# Altium project INCUBATION_CONTROLLER.PrjPcb
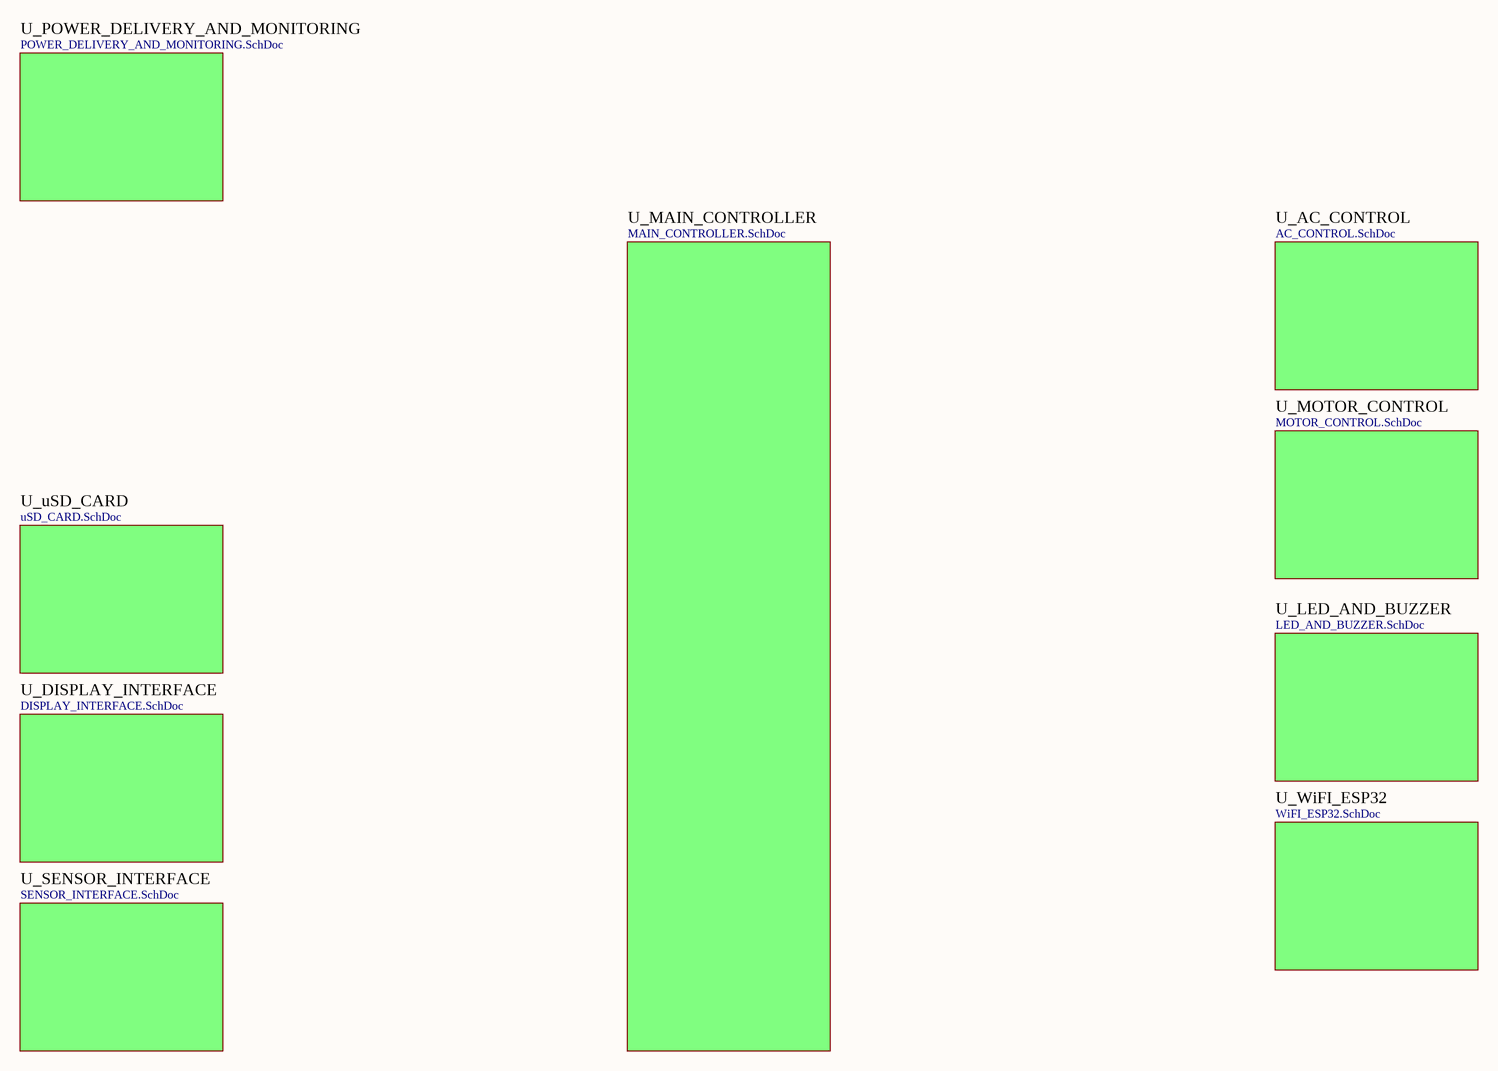
[diagram p0: MAIN.SchDoc]
13 sheets, 192 parts. Net scope: flat (ports and power ports of the same name join across sheets).
Board file: INCUBATION_CONTROLLER.PcbDoc
Sheets:
  MAIN.SchDoc
    U_POWER_DELIVERY_AND_MONITORING = POWER_DELIVERY_AND_MONITORING.SchDoc
      U_12V_SUPPLY = 12V_SUPPLY.SchDoc
      U_5V_SUPPLY = 5V_SUPPLY.SchDoc
      U_5V_ISOLATED_SUPPLY = 5V_ISOLATED_SUPPLY.SchDoc
      U_3V3_SUPPLY = 3V3_SUPPLY.SchDoc
      U_REVERSE_PROTECTION = REVERSE_PROTECTION.SchDoc
      U_3V3_MCU = 3V3_MCU.SchDoc
    U_AC_CONTROL = AC_CONTROL.SchDoc
    U_SENSOR_INTERFACE = SENSOR_INTERFACE.SchDoc
    U_LED_AND_BUZZER = LED_AND_BUZZER.SchDoc
    U_WiFI_ESP32 = WiFI_ESP32.SchDoc
    U_MAIN_CONTROLLER = MAIN_CONTROLLER.SchDoc

## Sheet MAIN.SchDoc
size A2; SheetNumber: 1; SheetTotal: 16

### Sub-sheets
U_AC_CONTROL = AC_CONTROL.SchDoc: no entries
U_DISPLAY_INTERFACE = DISPLAY_INTERFACE.SchDoc (file not in this document): no entries
U_LED_AND_BUZZER = LED_AND_BUZZER.SchDoc: no entries
U_MAIN_CONTROLLER = MAIN_CONTROLLER.SchDoc: no entries
U_MOTOR_CONTROL = MOTOR_CONTROL.SchDoc (file not in this document): no entries
U_POWER_DELIVERY_AND_MONITORING = POWER_DELIVERY_AND_MONITORING.SchDoc: no entries
U_SENSOR_INTERFACE = SENSOR_INTERFACE.SchDoc: no entries
U_uSD_CARD = uSD_CARD.SchDoc (file not in this document): no entries
U_WiFI_ESP32 = WiFI_ESP32.SchDoc: no entries

## Sheet POWER_DELIVERY_AND_MONITORING.SchDoc
size A4; SheetNumber: 2; SheetTotal: 16
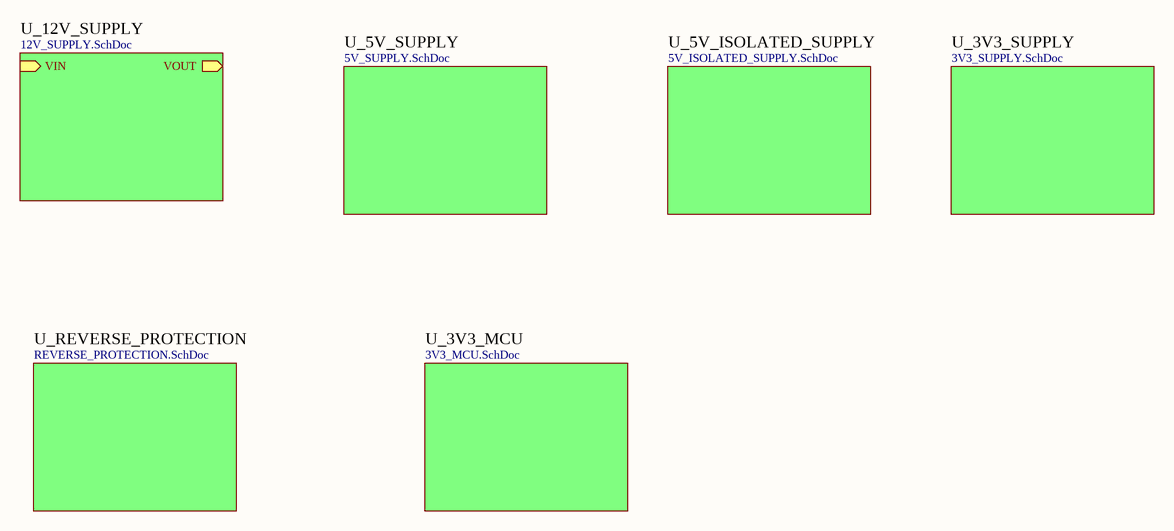
[diagram p1: POWER_DELIVERY_AND_MONITORING.SchDoc]

### Sub-sheets
U_3V3_MCU = 3V3_MCU.SchDoc: no entries
U_3V3_SUPPLY = 3V3_SUPPLY.SchDoc: no entries
U_5V_ISOLATED_SUPPLY = 5V_ISOLATED_SUPPLY.SchDoc: no entries
U_5V_SUPPLY = 5V_SUPPLY.SchDoc: no entries
U_12V_SUPPLY = 12V_SUPPLY.SchDoc: VIN (in), VOUT (out)
U_REVERSE_PROTECTION = REVERSE_PROTECTION.SchDoc: no entries

## Sheet 12V_SUPPLY.SchDoc
size A2; SheetNumber: 2; SheetTotal: 3
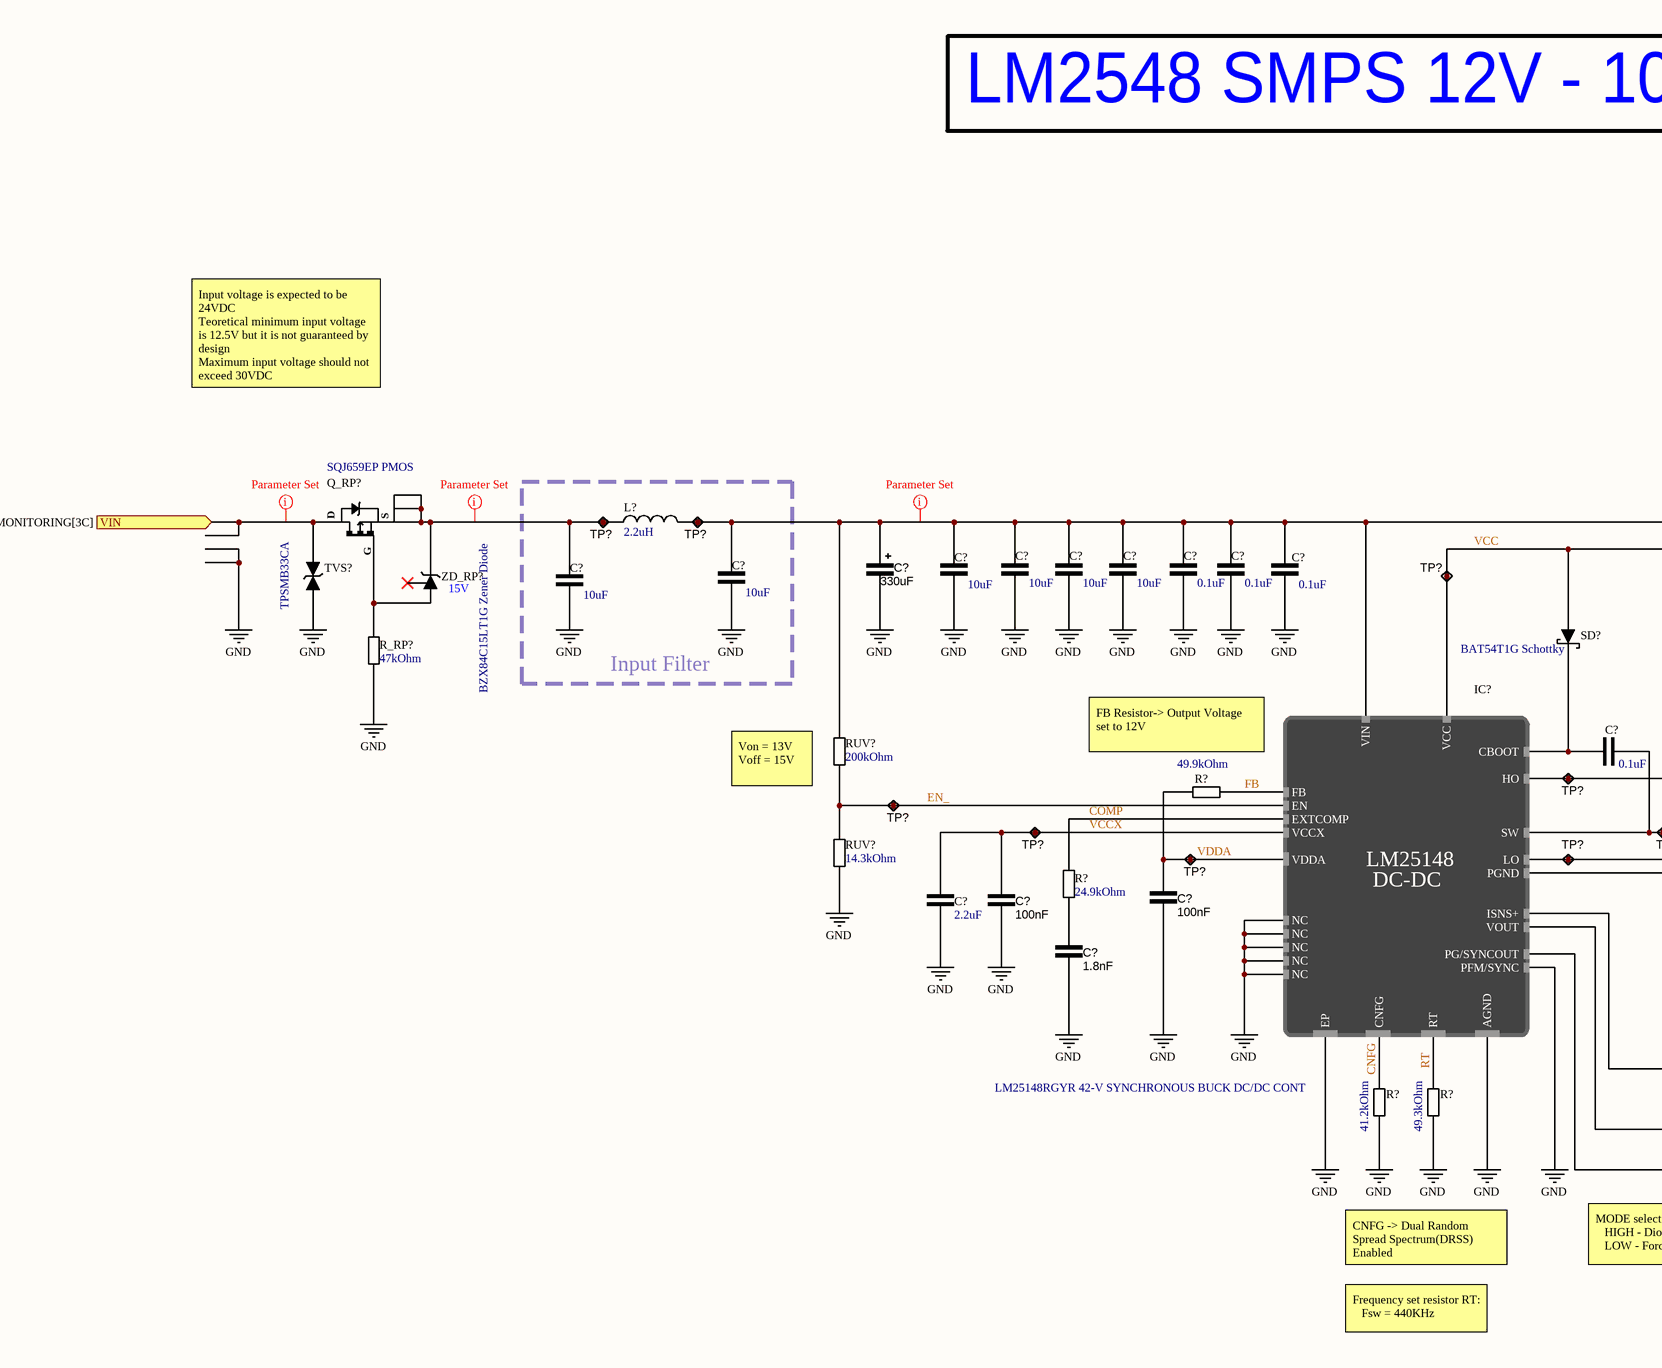
[diagram p2: 12V_SUPPLY.SchDoc, left]
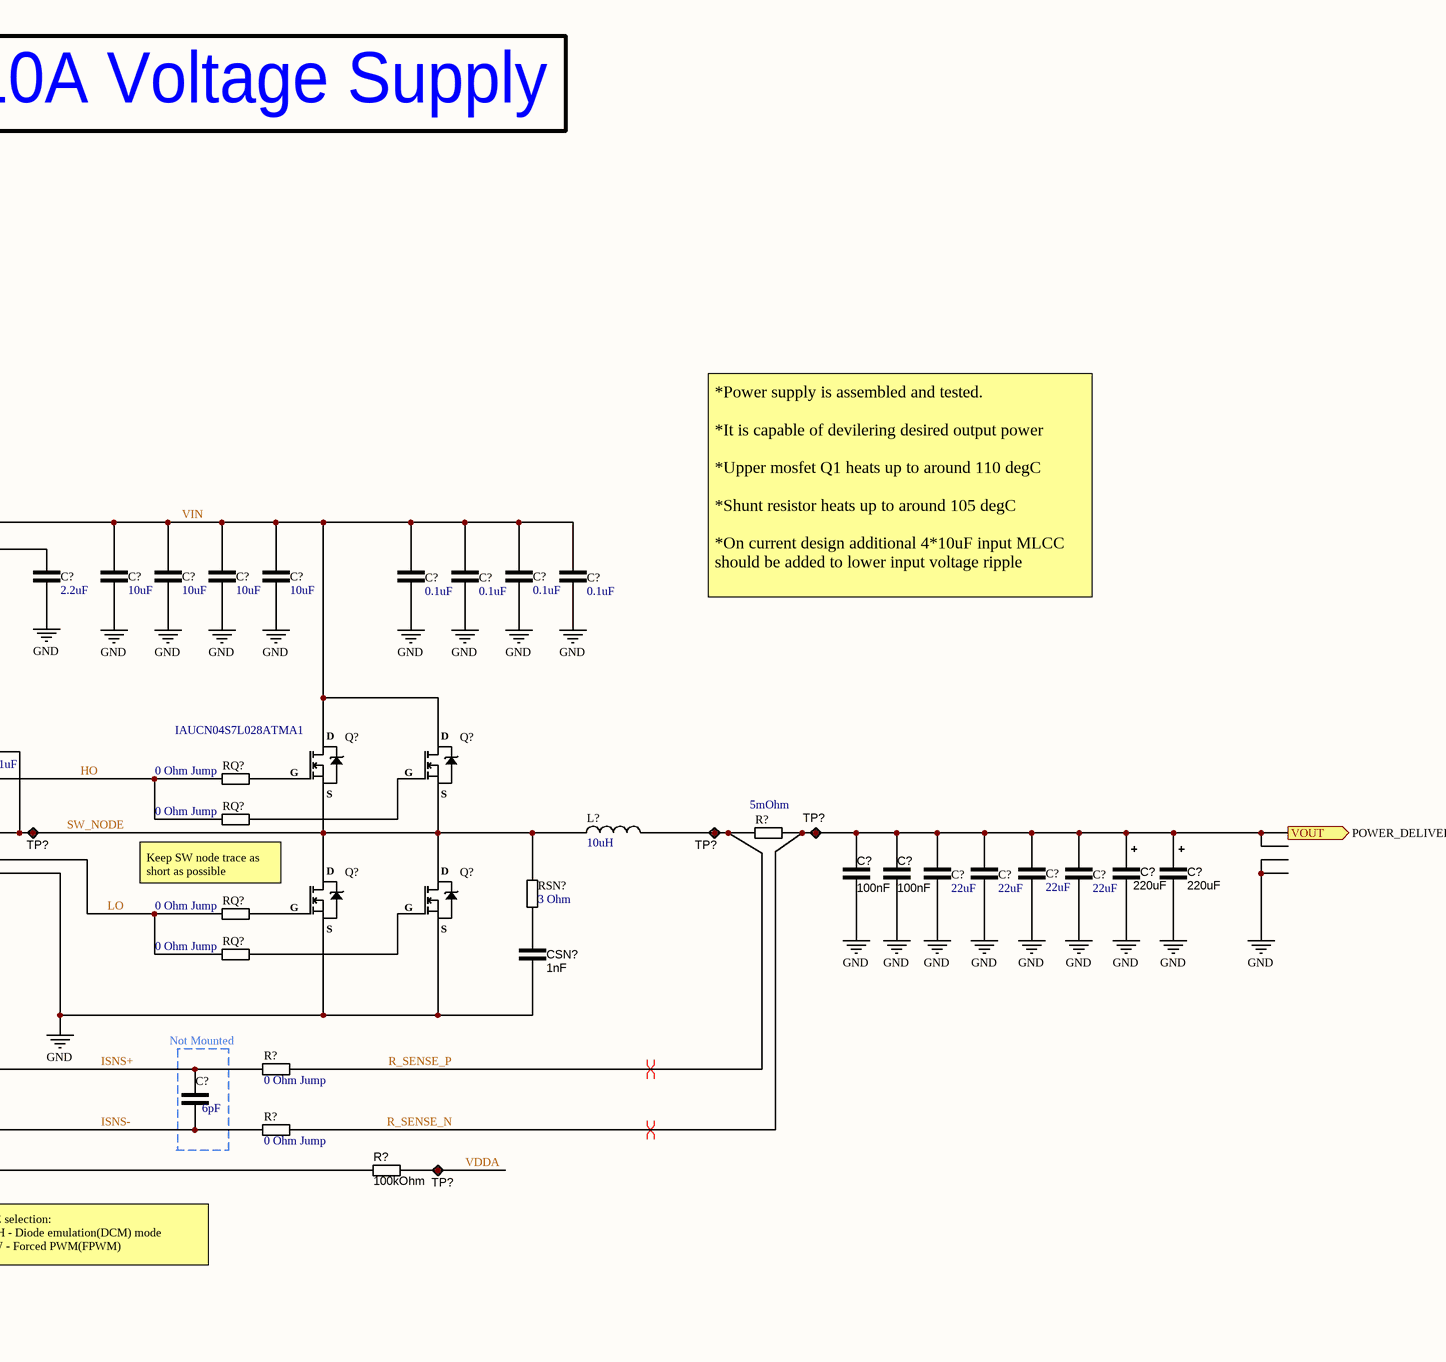
[diagram p3: 12V_SUPPLY.SchDoc, right]

### Parts
(Parts that share a designator on the sheet are numbered #1, #2 ... from top to bottom, then left to right.)
C?#1  330uF  [CAPAE109103X103M]
C?#2  10uF  [CAP_1206]
C?#3  10uF  [CAP_1206]
C?#4  10uF  [CAP_1206]
C?#5  10uF  [CAP_1206]
C?#6  0.1uF  [CAP_0603]
C?#7  0.1uF  [CAP_0603]
C?#8  0.1uF  [CAP_0603]
C?#9  10uF  [CAP_1206]
C?#10  2.2uF  [CAP_0603]
C?#11  10uF  [CAP_1206]
C?#12  10uF  [CAP_1206]
C?#13  10uF  [CAP_1206]
C?#14  10uF  [CAP_1206]
C?#15  0.1uF  [CAP_0603]
C?#16  0.1uF  [CAP_0603]
C?#17  0.1uF  [CAP_0603]
C?#18  0.1uF  [CAP_0603]
C?#19  10uF  [CAP_1206]
C?#20  0.1uF  [CAP_0603]
C?#21  100nF  [CAP_0603]
C?#22  100nF  [CAP_0603]
C?#23  22uF  [CAP_1210]
C?#24  22uF  [CAP_1210]
C?#25  22uF  [CAP_1210]
C?#26  22uF  [CAP_1210]
C?#27  220uF  [CAPAE109103X103M]
C?#28  220uF  [CAPAE109103X103M]
C?#29  2.2uF  [CAP_0603]
C?#30  100nF  [CAP_0603]
C?#31  100nF  [CAP_0603]
C?#32  1.8nF  [CAP_0603]
C?#33  6pF  [CAP_0402]
CSN?  1nF  [CAP_0805]
IC?#1  LM25148RGYR 42-V SYNCHRONOUS BUCK DC/DC CONT  [VQFN25_RGY_TEX]
L?#1  2.2uH  [IHLP-3232DZ-51]
L?#2  10uH  [INDP135126X65N]
Q?#1  IAUCN04S7L028ATMA1  [PG-TDSON-8-33]
Q?#2  IAUCN04S7L028ATMA1  [PG-TDSON-8-33]  (value not drawn)
Q?#3  IAUCN04S7L028ATMA1  [PG-TDSON-8-33]  (value not drawn)
Q?#4  IAUCN04S7L028ATMA1  [PG-TDSON-8-33]  (value not drawn)
Q_RP?  SQJ659EP PMOS  [PowerPAK SO-8L SINGLE]
R?#1  49.9kOhm  [RES_0603]
R?#2  5mOhm  [SENSE_RES_2512]
R?#3  24.9kOhm  [RES_0603]
R?#4  0 Ohm Jump  [RES_0402]
R?#5  41.2kOhm  [RES_0603]
R?#6  49.3kOhm  [RES_0603]
R?#7  0 Ohm Jump  [RES_0402]
R?#8  100kOhm  [RES_0603]
R_RP?  47kOhm  [RES_0603]
RQ?#1  0 Ohm Jump  [RES_0402]
RQ?#2  0 Ohm Jump  [RES_0402]
RQ?#3  0 Ohm Jump  [RES_0402]
RQ?#4  0 Ohm Jump  [RES_0402]
RSN?  3 Ohm  [RES_0805]
RUV?#1  200kOhm  [RES_0603]
RUV?#2  14.3kOhm  [RES_0603]
SD?  BAT54T1G Schottky  [SODFL371X135-2N]
TP?#1  Test point  [TestPoint]  (value not drawn)  (no BOM)
TP?#2  Test point  [TestPoint]  (value not drawn)  (no BOM)
TP?#3  Test point  [TestPoint]  (value not drawn)  (no BOM)
TP?#4  Test point  [TestPoint]  (value not drawn)  (no BOM)
TP?#5  Test point  [TestPoint]  (value not drawn)  (no BOM)
TP?#6  Test point  [TestPoint]  (value not drawn)  (no BOM)
TP?#7  Test point  [TestPoint]  (value not drawn)  (no BOM)
TP?#8  Test point  [TestPoint]  (value not drawn)  (no BOM)
TP?#9  Test point  [TestPoint]  (value not drawn)  (no BOM)
TP?#10  Test point  [TestPoint]  (value not drawn)  (no BOM)
TP?#11  Test point  [TestPoint]  (value not drawn)  (no BOM)
TP?#12  Test point  [TestPoint]  (value not drawn)  (no BOM)
TVS?  TPSMB33CA  [DO-214AA]
ZD_RP?  BZX84C15LT1G Zener Diode  [SOT95P245X96-3N]

### Blocks framed on the sheet
Input Filter: C?#9 C?#19 L?#1 TP?#1 TP?#2

### Ports
VIN (in, see POWER_DELIVERY_AND_MONITORING[3C]), VOUT (out, see POWER_DELIVERY_AND_MONITORING[4C])

### Nets
GND: C?#1.2 C?#2.1 C?#3.2 C?#4.2 C?#5.2 C?#6.2 C?#7.2 C?#8.1 C?#9.1 C?#10.1 C?#11.2 C?#12.2 C?#13.2 C?#14.2 C?#15.1 C?#16.1 C?#17.2 C?#18.1 C?#19.1 C?#21.1 C?#22.1 C?#23.2 C?#24.2 C?#25.1 C?#26.2 C?#27.2 C?#28.2 C?#29.2 C?#30.1 C?#31.1 C?#32.1 CSN?.1 IC?#1.1(NC) IC?#1.2(NC) IC?#1.7(AGND) IC?#1.10(PGND) IC?#1.18(PFM/SYNC) IC?#1.22(NC) IC?#1.23(NC) IC?#1.24(NC) IC?#1.25(EP) Q?#3.S(Source) Q?#4.S(Source) R?#5.1 R?#6.1 R_RP?.1 RUV?#2.1 TVS?.2(Anode)
CNFG: IC?#1.3(CNFG) R?#5.2
COMP: IC?#1.5(EXTCOMP) R?#3.2
EN_: IC?#1.19(EN) RUV?#1.1 RUV?#2.2 TP?#5.1
FB: IC?#1.6(FB) R?#1.2
HO: IC?#1.13(HO) RQ?#1.1 RQ?#2.1 TP?#4.1
ISNS+: C?#33.2 IC?#1.20(ISNS+) R?#4.1
ISNS-: C?#33.1 IC?#1.21(VOUT) R?#7.1
LO: IC?#1.11(LO) RQ?#3.1 RQ?#4.1 TP?#11.1
R_SENSE_N: C?#21.2 C?#22.2 C?#23.1 C?#24.1 C?#25.2 C?#26.1 C?#27.1 C?#28.1 R?#2.2 R?#7.2 TP?#9.1 ; port VOUT
R_SENSE_P: L?#2.2 R?#2.1 R?#4.2 TP?#8.1
RT: IC?#1.4(RT) R?#6.2
SW_NODE: C?#20.1 IC?#1.14(SW) L?#2.1 Q?#1.S(Source) Q?#2.S(Source) Q?#3.D(Drain) Q?#4.D(Drain) RSN?.2 TP?#7.1
VCC: C?#10.2 IC?#1.9(VCC) SD?.1(Anode) TP?#3.1
VCCX: C?#29.1 C?#30.2 IC?#1.16(VCCX) TP?#6.1
VDDA: C?#31.2 IC?#1.8(VDDA) R?#1.1 R?#8.2 TP?#10.1 TP?#12.1
VIN: C?#1.1 C?#2.2 C?#3.1 C?#4.1 C?#5.1 C?#6.1 C?#7.1 C?#8.2 C?#9.2 C?#11.1 C?#12.1 C?#13.1 C?#14.1 C?#15.2 C?#16.2 C?#17.1 C?#18.2 IC?#1.12(VIN) L?#1.2 Q?#1.D(Drain) Q?#2.D(Drain) RUV?#1.2 TP?#2.1
NetC?#19_2: C?#19.2 L?#1.1 Q_RP?.S(S1) TP?#1.1 ZD_RP?.3(Cathode)
NetC?#20_2: C?#20.2 IC?#1.15(CBOOT) SD?.2(Cathode)
NetC?#32_2: C?#32.2 R?#3.1
NetC?#61_2: Q_RP?.D TVS?.1(Cathode) ; port VIN
NetCSN?_2: CSN?.2 RSN?.1
NetIC?#1_17: IC?#1.17(PG/SYNCOUT) R?#8.1
NetQ?#1_G: Q?#1.G(Gate) RQ?#1.2
NetQ?#2_G: Q?#2.G(Gate) RQ?#2.2
NetQ?#3_G: Q?#3.G(Gate) RQ?#3.2
NetQ?#4_G: Q?#4.G(Gate) RQ?#4.2
NetQ_RP?_G: Q_RP?.G R_RP?.2 ZD_RP?.1(Anode)

Not connected (* = marked no-connect by the designer): ZD_RP? 2(Anode)*

### Layout directives
differential pair: R_SENSE_N, R_SENSE_P
rule Clearance Constraint [Clearance = 20mil]: NetC?#19_2, NetC?#61_2
rule Clearance Constraint [Generic clearance = 20mil, and 1 value(s) for objects]: VIN

### Notes on the sheet
- LM2548 SMPS 12V - 10A Voltage Supply
- Input voltage is expected to be 24VDC
  Teoretical minimum input voltage is 12.5V but it is not guaranteed by design
  Maximum input voltage should not exceed 30VDC
- (near ZD_RP?) 15V
- *Power supply is assembled and tested.
  *It is capable of devilering desired output power
  *Upper mosfet Q1 heats up to around 110 degC
  *Shunt resistor heats up to around 105 degC
  *On current design additional 4*10uF input MLCC should be added to lower input voltage ripple
- (near RUV?#1) Von = 13V
  Voff = 15V
- (near IC?#1) FB Resistor-> Output Voltage set to 12V
- Keep SW node trace as short as possible
- Not Mounted
- CNFG -> Dual Random Spread Spectrum(DRSS) Enabled
- MODE selection:
  HIGH - Diode emulation(DCM) mode
  LOW - Forced PWM(FPWM)
- Frequency set resistor RT:
  Fsw = 440KHz
- (in symbol LM25148RGYR) LM25148; DC-DC

### Library data of the parts
C?#1 = C000026: 330 µF 50 V Aluminum Electrolytic Capacitors Radial, Can - SMD 120mOhm @ 100kHz 2000 Hrs @ 105°C; Manufacturer Product Number: EMZR500ARA331MJA0G; capacitance: 330uF; ComponentLink1Description: DigiKey; ComponentLink1URL: https://www.digikey.com/en/products/detail/chemi-con/EMZR500ARA331MJA0G/5824768; DigiKey Part Number: 565-EMZR500ARA331MJA0GCT-ND
C?#2-C?#5 C?#9 C?#11-C?#14 C?#19 = C000017: 10 µF ±10% 50V Ceramic Capacitor X7R 1206 (3216 Metric); Manufacturer Product Number: CL31B106KBHNNNE; capacitance: 10uF; ComponentLink1Description: DigiKey; ComponentLink1URL: https://www.digikey.com/en/products/detail/samsung-electro-mechanics/CL31B106KBHNNNE/5961251; DigiKey Part Number: 1276-6767-1-ND
C?#6-C?#8 C?#15-C?#18 C?#20 = C000018: 0.1 µF ±10% 50V Ceramic Capacitor X7R 0603 (1608 Metric); Manufacturer Product Number: CL10B104KB8NNNC; capacitance: 0.1uF; ComponentLink1Description: DigiKey; ComponentLink1URL: https://www.digikey.com/en/products/detail/samsung-electro-mechanics/CL10B104KB8NNNC/3886658; DigiKey Part Number: 1276-1000-1-ND
C?#10 C?#29 = C000014: 8 pF ±0.05pF 25V Ceramic Capacitor C0G, NP0 01005 (0402 Metric); Manufacturer Product Number: GRM188C71C225KE11D; ComponentLink1Description: DigiKey; ComponentLink1URL: https://www.digikey.com/en/products/detail/murata-electronics/GRM188C71C225KE11D/4905311; DigiKey Part Number: 490-12731-1-ND; capacitance: 2.2uF
C?#21 C?#22 C?#30 C?#31 = C000007: 0.1 µF ±10% 25V Ceramic Capacitor X7R 0603 (1608 Metric); Manufacturer Product Number: KAM15AR71E104KT; ComponentLink1Description: DigiKey; ComponentLink1URL: https://www.digikey.com/en/products/detail/kyocera-avx/06033C104K4T2A/8019250; capacitance: 100nF; DigiKey Part Number: 478-KAM15AR71E104KTCT-ND
C?#23-C?#26 = C000032: 22 µF ±10% 25V Ceramic Capacitor X7R 1210 (3225 Metric); Manufacturer Product Number: CL32B226KAJNNNE; DigiKey Part Number: 1276-3392-1-ND; ComponentLink1Description: DigiKey; ComponentLink1URL: https://www.digikey.com/en/products/detail/samsung-electro-mechanics/CL32B226KAJNNNE/3889050; capacitance: 22uF
C?#27 C?#28 = C000033: 220 µF 35 V Aluminum - Polymer Capacitors Radial, Can - SMD 23mOhm 1000 Hrs @ 150°C; Manufacturer Product Number: A785MN227M1VLAS023; capacitance: 220uF; ComponentLink1Description: DigiKey; ComponentLink1URL: https://www.digikey.com/en/products/detail/kemet/A785MN227M1VLAS023/22003773?s=N4IgTCBcDaIIIHYAcBWAsgOTGBaCMAagDJwDKADGAMwgC6AvkA; DigiKey Part Number: 399-A785MN227M1VLAS023CT-ND
C?#32 = C000027: 1800 pF ±10% 25V Ceramic Capacitor X7R 0603 (1608 Metric); Manufacturer Product Number: C0603C182K3RACTU; ComponentLink1Description: DigiKey; ComponentLink1URL: https://www.digikey.com/en/products/detail/kemet/C0603C182K3RAC7867/2200107; DigiKey Part Number: 399-15370-1-ND; capacitance: 1.8nF
C?#33 = C000016: 6 pF ±0.5pF 25V Ceramic Capacitor C0G, NP0 0402 (1005 Metric); Manufacturer Product Number: CBR04C609D3GAC; DigiKey Part Number: 399-CBR04C609D3GACCT-ND; ComponentLink1Description: DigiKey; ComponentLink1URL: https://www.digikey.com/en/products/detail/kemet/CBR04C609D3GAC/18137865?s=N4IgjCBcpgLFoDGUBmBDANgZwKYBoQB7KAbXAFYBOAJlgHYQBdAgBwBcoQBlNgJwEsAdgHMQAXwJgAbAhDJI6bPiKkQAZkphyADiasOkbnyGiJIagAZYlWfMW4CxSGSkACFgDE9IdpwCqgvxsAPIoALI4aFgArrw44gQAtNS2UHzRyk5k5ExieUA; capacitance: 6pF
CSN? = C000035: 1000 pF ±10% 100V Ceramic Capacitor X7R 0805 (2012 Metric); Manufacturer Product Number: CC0805KRX7R0BB102; capacitance: 1nF; ComponentLink1Description: DigiKey; ComponentLink1URL: https://www.digikey.com/en/products/detail/yageo/CC0805KRX7R0BB102/2833637; DigiKey Part Number: 311-1472-1-ND
IC?#1 = LM25148RGYR: Buck Regulator Positive Output Step-Down DC-DC Controller IC 24-VQFN (5.5x3.5); DigiKey Part Number: 296-LM25148RGYRCT-ND; Mouser Part Number: 595-LM25148RGYR; ComponentLink1Description: DigiKey; ComponentLink1URL: https://www.digikey.com/en/products/detail/texas-instruments/LM25148RGYR/15857124; ComponentLink2Description: Mouser; ComponentLink2URL: https://eu.mouser.com/ProductDetail/Texas-Instruments/LM25148RGYR?qs=doiCPypUmgEViljGB5jAZw%3D%3D; Manufacturer Product Number: LM25148RGYR
L?#1 = L000015: FIXED IND 2.2UH 11.5A 12.5 MOHM; Manufacturer Product Number: IHLP3232DZER2R2M5A; inductance: 2.2uH; DigiKey Part Number: 541-IHLP3232DZER2R2M5ACT-ND; ComponentLink1Description: DigiKey; ComponentLink1URL: https://www.digikey.com/en/products/detail/vishay-dale/IHLP3232DZER2R2M5A/4070222; case: 3232; Mouser Part Number: 70-IHLP3232DZR2R2M5A; ComponentLink2Description: Mouser; ComponentLink2URL: https://eu.mouser.com/ProductDetail/Vishay-Dale/IHLP3232DZER2R2M5A?qs=tDDpbAIEejr3%252BeiaEh99%252Bg%3D%3D
L?#2 = L000016: FIXED IND 10UH 11A 15.8 MOHM SMD; Manufacturer Product Number: PA4343.103ANLT; inductance: 10uH; DigiKey Part Number: 553-4029-1-ND; ComponentLink1Description: DigiKey; ComponentLink1URL: https://www.digikey.com/en/products/detail/pulse-electronics/PA4343-103ANLT/7943151?s=N4IgTCBcDaIAoEEAsBmVA6AjABhQgcgDIAqIAugL5A; case: 13.5x12.6; Mouser Part Number: 673-PA4343.103ANLT; ComponentLink2Description: Mouser; ComponentLink2URL: https://eu.mouser.com/ProductDetail/Pulse-Electronics/PA4343.103ANLT?qs=chTDxNqvsym%252BWuIQdh7qfw%3D%3D
Q?#1-Q?#4 = 00000014: N-Channel 40 V 100A Surface Mount PG-TDSON-8-33; DigiKey Part Number: 448-IAUCN04S7L028ATMA1CT-ND; Mouser Part Number: 726-IAUCN04S7L028ATM; ComponentLink1Description: DigiKey; ComponentLink1URL: https://www.digikey.com/en/products/detail/infineon-technologies/IAUCN04S7L028ATMA1/22157720?s=N4IgTCBcDaIJIEECqBhAcgBgCwGUDsAMhmABwgC6AvkA; ComponentLink2Description: Mouser; ComponentLink2URL: https://eu.mouser.com/ProductDetail/Infineon-Technologies/IAUCN04S7L028ATMA1?qs=mELouGlnn3deeHozE86VbA%3D%3D; ComponentLink3Description: Footprint Drawing; ComponentLink3URL: https://www.infineon.com/cms/en/product/packages/PG-TDSON/PG-TDSON-8-33/; Manufacturer Product Number: IAUCN04S7L028ATMA1
Q_RP? = 00000005: P-Channel 60 V 52A (Tc) 83W (Tc) Surface Mount PowerPAK® SO-8; Manufacturer Product Number: SQJ459EP-T1_GE3; DigiKey Part Number: SQJ459EP-T1_GE3CT-ND; Mouser Part Number: 78-SQJ459EP-T2_BE3; ComponentLink1Description: DigiKey; ComponentLink1URL: https://www.digikey.com/en/products/detail/vishay-siliconix/SQJ459EP-T1-GE3/6708881; ComponentLink2Description: Mouser; ComponentLink2URL: https://eu.mouser.com/ProductDetail/Vishay-Siliconix/SQJ459EP-T2_BE3?qs=CiayqK2gdcKpg8h0vLRPjA%3D%3D
R?#1 = R000025: 49.9 kOhms ±1% 0.1W, 1/10W Chip Resistor 0603 (1608 Metric) Moisture Resistant Thick Film; Manufacturer Product Number: CRCW060349K9FKEA; ComponentLink1Description: DigiKey; ComponentLink1URL: https://www.digikey.com/en/products/detail/vishay-dale/CRCW060349K9FKEA/1180003; resistance: 49.9kOhm; DigiKey Part Number: 541-49.9KHCT-ND
R?#2 = R000033: 5 mOhms ±1% 2W Chip Resistor 2512 (6332 Metric) Automotive AEC-Q200, Current Sense, Moisture Resistant Metal Element; Manufacturer Product Number: CRF2512-FZ-R005ELF; ComponentLink1Description: DigiKey; ComponentLink1URL: https://www.digikey.com/en/products/detail/bourns-inc/CRF2512-FZ-R005ELF/6210986; resistance: 5mOhm; DigiKey Part Number: CRF2512-FZ-R005ELFCT-ND
R?#3 = R000017: 24.9 kOhms ±1% 0.1W, 1/10W Chip Resistor 0603 (1608 Metric) Automotive AEC-Q200 Thick Film; Manufacturer Product Number: ERJ-3EKF2492V; ComponentLink1Description: DigiKey; ComponentLink1URL: https://www.digikey.com/en/products/detail/panasonic-electronic-components/ERJ-3EKF2492V/196236; resistance: 24.9kOhm; DigiKey Part Number: P24.9KHCT-ND
R?#4 R?#7 RQ?#1-RQ?#4 = R000008: 0 Ohms Jumper Chip Resistor 0402 (1005 Metric) Automotive AEC-Q200 Thick Film; Manufacturer Product Number: ERJ-2GE0R00X; resistance: 0 Ohm Jump; DigiKey Part Number: P0.0JCT-ND; ComponentLink1Description: DigiKey; ComponentLink1URL: https://www.digikey.com/en/products/detail/panasonic-electronic-components/ERJ-2GE0R00X/146727
R?#5 = R000015: 41.2 kOhms ±1% 0.1W, 1/10W Chip Resistor 0603 (1608 Metric) Automotive AEC-Q200 Thick Film; Manufacturer Product Number: ERJ-3EKF4122V; ComponentLink1Description: DigiKey; ComponentLink1URL: https://www.digikey.com/en/products/detail/panasonic-electronic-components/ERJ-3EKF4122V/196347; resistance: 41.2kOhm; DigiKey Part Number: P41.2KHCT-ND
R?#6 = R000023: 49.3 kOhms ±0.1% 0.1W, 1/10W Chip Resistor 0603 (1608 Metric) Thin Film; Manufacturer Product Number: RT0603BRD0749K3L; ComponentLink1Description: DigiKey; ComponentLink1URL: https://www.digikey.com/en/products/detail/yageo/RT0603BRD0749K3L/5927964; resistance: 49.3kOhm; DigiKey Part Number: 13-RT0603BRD0749K3LCT-ND
R?#8 = R000006: 100 kOhms ±1% 0.1W, 1/10W Chip Resistor 0603 (1608 Metric) Automotive AEC-Q200 Thick Film; Manufacturer Product Number: RMCF0603FG100K; resistance: 100kOhm; ComponentLink1Description: DigiKey; ComponentLink1URL: https://www.digikey.com/en/products/detail/stackpole-electronics-inc/RMCF0603FG100K/1713543; DigiKey Part Number: RMCF0603FG100KCT-ND
R_RP? = R000010: 47 kOhms ±1% 0.1W, 1/10W Chip Resistor 0603 (1608 Metric) Moisture Resistant Thick Film; Manufacturer Product Number: RC0603FR-0747KL; ComponentLink1Description: DigiKey; ComponentLink1URL: https://www.digikey.com/en/products/detail/yageo/RC0603FR-0747KL/727253; resistance: 47kOhm; DigiKey Part Number: 311-47.0KHRCT-ND
RSN? = R000034: 3 Ohms ±1% 0.125W, 1/8W Chip Resistor 0805 (2012 Metric) Moisture Resistant Thick Film; Manufacturer Product Number: RC0805FR-073RL; ComponentLink1Description: DigiKey; ComponentLink1URL: https://www.digikey.com/en/products/detail/yageo/RC0805FR-073RL/727799; resistance: 3 Ohm; DigiKey Part Number: 311-3.00CRCT-ND
RUV?#1 = R000031: 200 kOhms ±1% 0.1W, 1/10W Chip Resistor 0603 (1608 Metric) Moisture Resistant Thick Film; Manufacturer Product Number: RC0603FR-07200KL; ComponentLink1Description: DigiKey; ComponentLink1URL: https://www.digikey.com/en/products/detail/yageo/RC0603FR-07200KL/727044; resistance: 200kOhm; DigiKey Part Number: 311-200KHRCT-ND
RUV?#2 = R000032: 14.3 kOhms ±1% 0.1W, 1/10W Chip Resistor 0603 (1608 Metric) Automotive AEC-Q200 Thick Film; Manufacturer Product Number: RMCF0603FT14K3; ComponentLink1Description: DigiKey; ComponentLink1URL: https://www.digikey.com/en/products/detail/stackpole-electronics-inc/RMCF0603FT14K3/1761296; resistance: 14.3kOhm; DigiKey Part Number: RMCF0603FT14K3CT-ND
SD? = 00000009: Diode 30 V 200mA Surface Mount SOD-123; DigiKey Part Number: BAT54T1GOSCT-ND; ComponentLink1Description: DigiKey; ComponentLink1URL: https://www.digikey.com/en/products/detail/onsemi/BAT54T1G/918319; Manufacturer Product Number: BAT54T1G
TP?#1-TP?#12 = TP002: Test point 1mm
TVS? = 00000015: 45.7V Clamp 13.3A Ipp Tvs Diode Surface Mount DO-214AA (SMBJ); DigiKey Part Number: F6323CT-ND; ComponentLink1Description: DigiKey; ComponentLink1URL: https://www.digikey.com/en/products/detail/littelfuse-inc/TPSMB33CA/4835275; Manufacturer Product Number: TPSMB33CA
ZD_RP? = 00000016: Zener Diode 15 V 250 mW ±6% Surface Mount SOT-23-3 (TO-236); DigiKey Part Number: BZX84C15LT1GOSCT-ND; ComponentLink1Description: DigiKey; ComponentLink1URL: https://www.digikey.com/en/products/detail/onsemi/BZX84C15LT1G/918390; Manufacturer Product Number: BZX84C15LT1G; JLCPCB Part Number: C80857

## Sheet 5V_SUPPLY.SchDoc
size A4; SheetNumber: 4; SheetTotal: 16
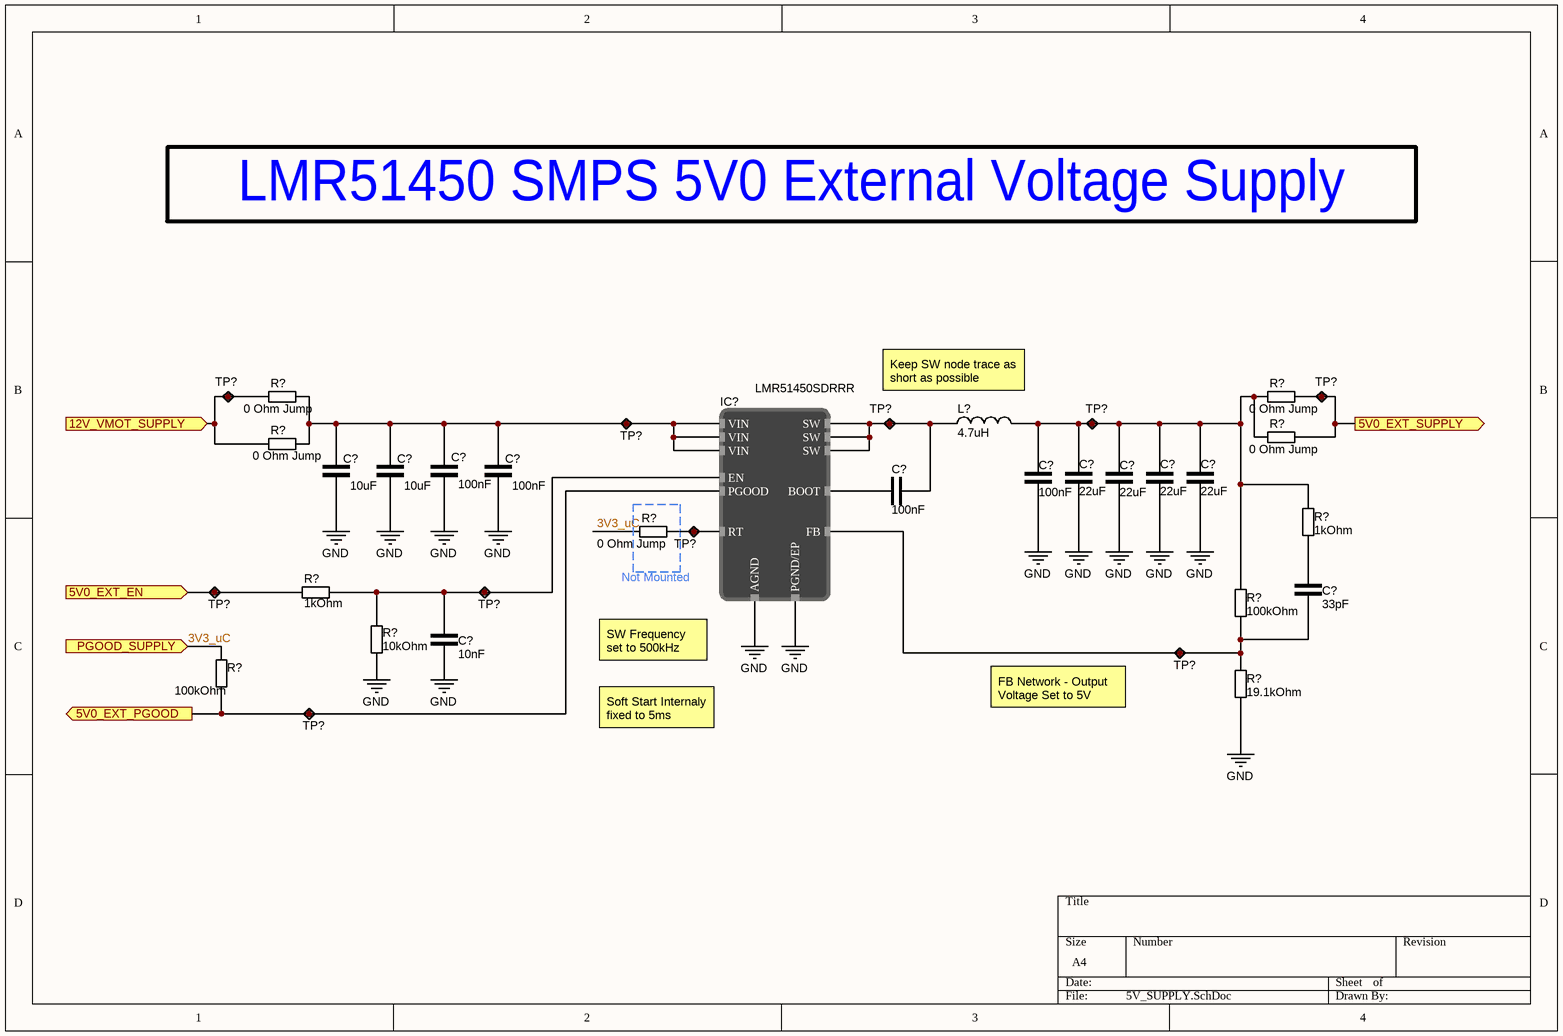
[diagram p4: 5V_SUPPLY.SchDoc]

### Parts
(Parts that share a designator on the sheet are numbered #1, #2 ... from top to bottom, then left to right.)
C?#34  10uF  [CAP_0805]
C?#35  10uF  [CAP_0805]
C?#36  100nF  [CAP_0603]
C?#37  100nF  [CAP_0603]
C?#38  100nF  [CAP_0603]
C?#39  22uF  [CAP_0805]
C?#40  22uF  [CAP_0805]
C?#41  22uF  [CAP_0805]
C?#42  22uF  [CAP_0805]
C?#43  100nF  [CAP_0603]
C?#44  33pF  [CAP_0603]
C?#45  10nF  [CAP_0603]
IC?#2  LMR51450SDRRR  [SON50P300X80_HS-13N]
L?#3  4.7uH  [INDP6965X30N]
R?#9  0 Ohm Jump  [RES_0805]
R?#10  0 Ohm Jump  [RES_1206]
R?#11  0 Ohm Jump  [RES_1206]
R?#12  0 Ohm Jump  [RES_0805]
R?#13  1kOhm  [RES_0603]
R?#14  0 Ohm Jump  [RES_0603]
R?#15  1kOhm  [RES_0603]
R?#16  100kOhm  [RES_0603]
R?#17  10kOhm  [RES_0603]
R?#18  100kOhm  [RES_0603]
R?#19  19.1kOhm  [RES_0603]
TP?#13  Test point  [TestPoint]  (value not drawn)
TP?#14  Test point  [TestPoint]  (value not drawn)
TP?#15  Test point  [TestPoint]  (value not drawn)
TP?#16  Test point  [TestPoint]  (value not drawn)
TP?#17  Test point  [TestPoint]  (value not drawn)
TP?#18  Test point  [TestPoint]  (value not drawn)
TP?#19  Test point  [TestPoint]  (value not drawn)
TP?#20  Test point  [TestPoint]  (value not drawn)
TP?#21  Test point  [TestPoint]  (value not drawn)
TP?#22  Test point  [TestPoint]  (value not drawn)

### Ports
5V0_EXT_EN (in), 5V0_EXT_PGOOD (out), 5V0_EXT_SUPPLY (out), 12V_VMOT_SUPPLY (in), PGOOD_SUPPLY (in)

### Nets
GND: C?#34.1 C?#35.1 C?#36.2 C?#37.1 C?#38.1 C?#39.1 C?#40.2 C?#41.1 C?#42.1 C?#45.1 IC?#2.8(AGND) IC?#2.13(PGND/EP) R?#17.1 R?#19.1
3V3_uC: R?#14.1 R?#18.2 ; port PGOOD_SUPPLY
NetC?#34_2: C?#34.2 C?#35.2 C?#36.1 C?#37.2 IC?#2.10(VIN) IC?#2.11(VIN) IC?#2.12(VIN) R?#9.2 R?#12.2 TP?#15.1
NetC?#38_2: C?#38.2 C?#39.2 C?#40.1 C?#41.2 C?#42.2 L?#3.2 R?#10.1 R?#11.1 R?#13.2 R?#16.2 TP?#17.1
NetC?#43_1: C?#43.1 IC?#2.4(BOOT)
NetC?#43_2: C?#43.2 IC?#2.1(SW) IC?#2.2(SW) IC?#2.3(SW) L?#3.1 TP?#16.1
NetC?#44_1: C?#44.1 IC?#2.7(FB) R?#16.1 R?#19.2 TP?#21.1
NetC?#44_2: C?#44.2 R?#13.1
NetC?#45_2: C?#45.2 IC?#2.9(EN) R?#15.2 R?#17.2 TP?#20.1
NetIC?#2_5: IC?#2.5(PGOOD) R?#18.1 TP?#22.1 ; port 5V0_EXT_PGOOD
NetIC?#2_6: IC?#2.6(RT) R?#14.2 TP?#18.1
NetR?#9_1: R?#9.1 R?#12.1 TP?#13.1 ; port 12V_VMOT_SUPPLY
NetR?#10_2: R?#10.2 R?#11.2 TP?#14.1 ; port 5V0_EXT_SUPPLY
NetR?#15_1: R?#15.1 TP?#19.1 ; port 5V0_EXT_EN

### Notes on the sheet
- LMR51450 SMPS 5V0 External Voltage Supply
- Keep SW node trace as short as possible
- Not Mounted
- (near IC?#2) SW Frequency set to 500kHz
- FB Network - Output Voltage Set to 5V
- Soft Start Internaly fixed to 5ms

### Library data of the parts
C?#34 C?#35 = C000002: 10 µF ±10% 25V Ceramic Capacitor X5R 0805 (2012 Metric); ComponentLink1Description: DigiKey; ComponentLink1URL: https://www.digikey.com/en/products/detail/tdk-corporation/C2012X5R1E106K125AB/2443462; DigiKey Part Number: 445-5984-1-ND; capacitance: 10uF
C?#36-C?#38 C?#43 = C000007: 0.1 µF ±10% 25V Ceramic Capacitor X7R 0603 (1608 Metric); ComponentLink1Description: DigiKey; ComponentLink1URL: https://www.digikey.com/en/products/detail/kyocera-avx/06033C104K4T2A/8019250; DigiKey Part Number: 478-KAM15AR71E104KTCT-ND; capacitance: 100nF
C?#39-C?#42 = C000001: 22 µF ±20% 25V Ceramic Capacitor X5R 0805 (2012 Metric); ComponentLink1Description: DigiKey; ComponentLink1URL: https://www.digikey.com/en/products/detail/tdk-corporation/C2012X5R1E226M125AC/3661564; DigiKey Part Number: 445-9112-1-ND; capacitance: 22uF
C?#44 = C000029: 33 pF ±5% 25V Ceramic Capacitor C0G, NP0 0603 (1608 Metric); ComponentLink1Description: DigiKey; ComponentLink1URL: https://www.digikey.com/en/products/detail/yageo/CC0603JRNPO8BN330/5883595; DigiKey Part Number: 311-3954-1-ND; capacitance: 33pF
C?#45 = C000005: 10000 pF ±20% 25V Ceramic Capacitor X7R 0603 (1608 Metric); ComponentLink1Description: DigiKey; ComponentLink1URL: https://www.digikey.com/en/products/detail/kyocera-avx/06033C103MAT2A/1599370; DigiKey Part Number: 478-KGM15AR71E103MTCT-ND; capacitance: 10nF
IC?#2 = LMR51450SDRRR: Buck Switching Regulator IC Positive Adjustable 0.8V 1 Output 5A 12-WFDFN Exposed Pad; DigiKey Part Number: 296-LMR51450SDRRRCT-ND; ComponentLink1Description: DigiKey; ComponentLink1URL: https://www.digikey.com/en/products/detail/texas-instruments/LMR51450SDRRR/17394946; Mouser Part Number: 595-LMR51450SDRRR; ComponentLink2Description: Mouser; ComponentLink2URL: https://eu.mouser.com/ProductDetail/Texas-Instruments/LMR51450SDRRR?qs=rQFj71Wb1eUvKinsjoLiUA%3D%3D
L?#3 = L000011: FIXED IND 4.7UH 5.5A 40 MOHM SMD; inductance: 4.7uH; DigiKey Part Number: 541-1010-1-ND; ComponentLink1Description: DigiKey; ComponentLink1URL: https://www.digikey.com/en/products/detail/vishay-dale/IHLP2525CZER4R7M01/1220675
R?#9 R?#12 = R000011: 0 Ohms Jumper Chip Resistor 0805 (2012 Metric) Automotive AEC-Q200 Thick Film; ComponentLink1Description: DigiKey; ComponentLink1URL: https://www.digikey.com/en/products/detail/panasonic-electronic-components/ERJ-6GEY0R00V/78163; resistance: 0 Ohm Jump; DigiKey Part Number: P0.0ACT-ND
R?#10 R?#11 = R000012: 0 Ohms Jumper Chip Resistor 1206 (3216 Metric) Automotive AEC-Q200 Thick Film; ComponentLink1Description: DigiKey; ComponentLink1URL: https://www.digikey.com/en/products/detail/stackpole-electronics-inc/RMCF1206ZT0R00/1756906; resistance: 0 Ohm Jump; DigiKey Part Number: RMCF1206ZT0R00CT-ND
R?#13 R?#15 = R000004: 1 kOhms ±1% 0.125W, 1/8W Chip Resistor 0603 (1608 Metric) Anti-Sulfur Thin Film; resistance: 1kOhm; ComponentLink1Description: DigiKey; ComponentLink1URL: https://www.digikey.com/en/products/detail/vishay-beyschlag-draloric-bc-components/MCT06030C1001FP500/2607821; DigiKey Part Number: MCT0603-1.00K-CFCT-ND
R?#14 = R000007: 0 Ohms Jumper Chip Resistor 0603 (1608 Metric) Automotive AEC-Q200 Thick Film; ComponentLink1Description: DigiKey; ComponentLink1URL: https://www.digikey.com/en/products/detail/stackpole-electronics-inc/RMCF0603ZT0R00/1756908; resistance: 0 Ohm Jump; DigiKey Part Number: RMCF0603ZT0R00CT-ND
R?#16 R?#18 = R000006: 100 kOhms ±1% 0.1W, 1/10W Chip Resistor 0603 (1608 Metric) Automotive AEC-Q200 Thick Film; resistance: 100kOhm; ComponentLink1Description: DigiKey; ComponentLink1URL: https://www.digikey.com/en/products/detail/stackpole-electronics-inc/RMCF0603FG100K/1713543; DigiKey Part Number: RMCF0603FG100KCT-ND
R?#17 = R000001: 10 kOhms ±1% 0.125W, 1/8W Chip Resistor 0603 (1608 Metric) Anti-Sulfur Thin Film; resistance: 10kOhm; ComponentLink1Description: DigiKey; ComponentLink1URL: https://www.digikey.com/en/products/detail/vishay-beyschlag-draloric-bc-components/MCT06030C1002FP500/1850440; DigiKey Part Number: MCT0603-10.0K-CFCT-ND
R?#19 = R000020: 19.1 kOhms ±1% 0.1W, 1/10W Chip Resistor 0603 (1608 Metric) Moisture Resistant Thick Film; ComponentLink1Description: DigiKey; ComponentLink1URL: https://www.digikey.com/en/products/detail/yageo/RC0603FR-0719K1L/727001; resistance: 19.1kOhm; DigiKey Part Number: 311-19.1KHRCT-ND
TP?#13-TP?#22 = TP002: Test point 1mm

## Sheet 5V_ISOLATED_SUPPLY.SchDoc
size A4; SheetNumber: 6; SheetTotal: 16

## Sheet 3V3_SUPPLY.SchDoc
size A2; SheetNumber: 5; SheetTotal: 16
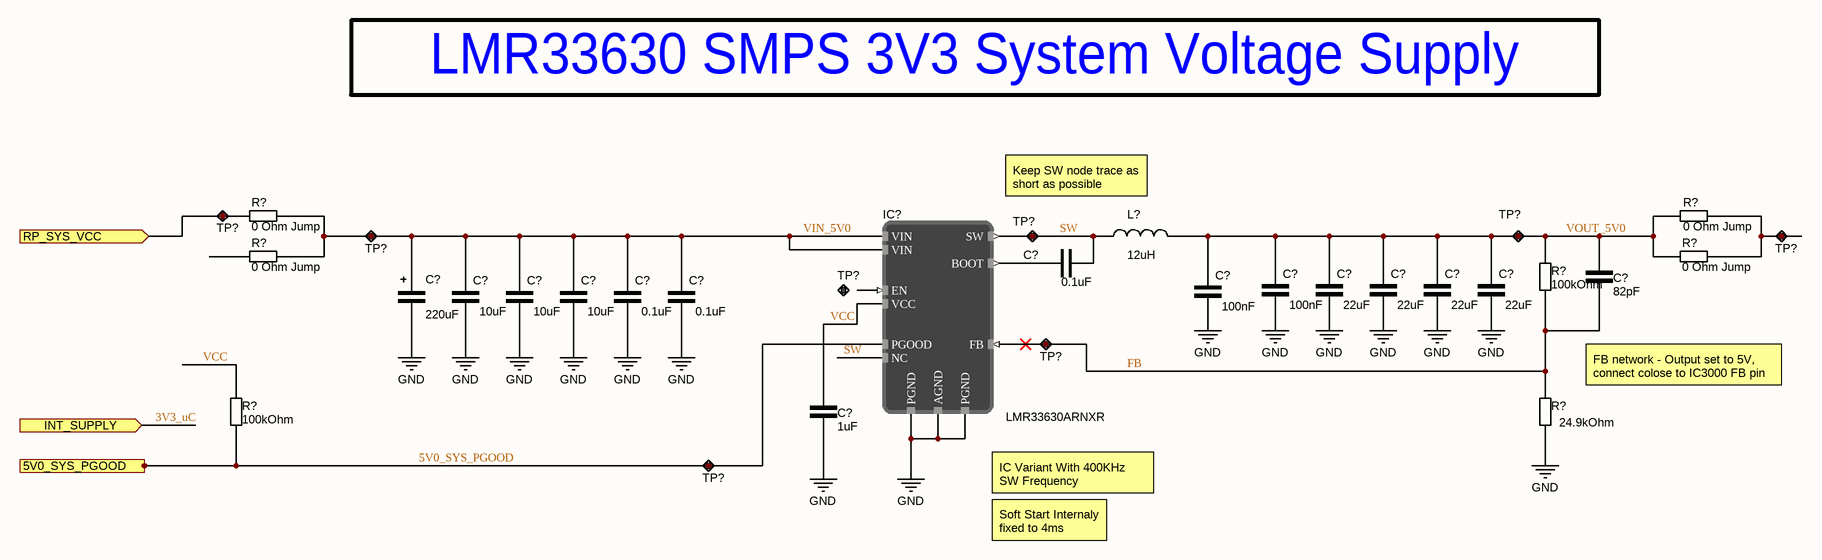
[diagram p5: 3V3_SUPPLY.SchDoc]

### Parts
(Parts that share a designator on the sheet are numbered #1, #2 ... from top to bottom, then left to right.)
C?#46  0.1uF  [CAP_0603]
C?#47  82pF  [CAP_0603]
C?#48  100nF  [CAP_0603]
C?#49  100nF  [CAP_0603]
C?#50  22uF  [CAP_1206]
C?#51  22uF  [CAP_1206]
C?#52  22uF  [CAP_1206]
C?#53  22uF  [CAP_1206]
C?#54  220uF  [CAPAE109103X103M]
C?#55  10uF  [CAP_1206]
C?#56  10uF  [CAP_1206]
C?#57  10uF  [CAP_1206]
C?#58  0.1uF  [CAP_0603]
C?#59  0.1uF  [CAP_0603]
C?#60  1uF  [CAP_0603]
IC?#3  LMR33630ARNXR  [VQFN-HR]
L?#4  12uH  [INDM120120X80N]
R?#20  0 Ohm Jump  [RES_0805]
R?#21  0 Ohm Jump  [RES_1206]
R?#22  0 Ohm Jump  [RES_0805]
R?#23  0 Ohm Jump  [RES_1206]
R?#24  100kOhm  [RES_0603]
R?#25  100kOhm  [RES_0603]
R?#26  24.9kOhm  [RES_0603]
TP?#23  Test point  [TestPoint]  (value not drawn)
TP?#24  Test point  [TestPoint]  (value not drawn)
TP?#25  Test point  [TestPoint]  (value not drawn)
TP?#26  Test point  [TestPoint]  (value not drawn)
TP?#27  Test point  [TestPoint]  (value not drawn)
TP?#28  Test point  [TestPoint]  (value not drawn)
TP?#29  Test point  [TestPoint]  (value not drawn)
TP?#30  Test point  [TestPoint]  (value not drawn)

### Ports
5V0_SYS_PGOOD (out), INT_SUPPLY (in), RP_SYS_VCC (in)

### Nets
GND: C?#49.1 C?#50.1 C?#51.1 C?#52.1 C?#53.1 C?#54.1 C?#55.1 C?#56.1 C?#57.1 C?#58.1 C?#59.1 C?#60.1 IC?#3.1(PGND) IC?#3.6(AGND) IC?#3.11(PGND) R?#26.1
3V3_uC: port INT_SUPPLY
5V0_SYS_PGOOD: IC?#3.8(PGOOD) R?#25.1 TP?#30.1 ; port 5V0_SYS_PGOOD
FB: C?#47.1 IC?#3.7(FB) R?#24.1 R?#26.2 TP?#29.1
SW: C?#46.2 IC?#3.3(NC) IC?#3.12(SW) L?#4.1 TP?#25.1
VCC: C?#60.2 IC?#3.5(VCC) R?#25.2
VIN_5V0: C?#54.2 C?#55.2 C?#56.2 C?#57.2 C?#58.2 C?#59.2 IC?#3.2(VIN) IC?#3.10(VIN) R?#20.2 R?#22.2 TP?#24.1
VOUT_5V0: C?#47.2 C?#48.2 C?#49.2 C?#50.2 C?#51.2 C?#52.2 C?#53.2 L?#4.2 R?#21.2 R?#23.1 R?#24.2 TP?#26.1
NetC?#46_1: C?#46.1 IC?#3.4(BOOT)
NetR?#20_1: R?#20.1 TP?#23.1 ; port RP_SYS_VCC
NetR?#21_1: R?#21.1 R?#23.2 TP?#27.1

Not connected (* = marked no-connect by the designer): C?#48 1; IC?#3 9(EN); R?#22 1; TP?#28 1

### Notes on the sheet
- LMR33630 SMPS 3V3 System Voltage Supply
- Keep SW node trace as short as possible
- FB network - Output set to 5V, connect colose to IC3000 FB pin
- (near IC?#3) IC Variant With 400KHz SW Frequency
- Soft Start Internaly fixed to 4ms
- Labels drawn without touching a wire or pin: GND

### Library data of the parts
C?#46 C?#58 C?#59 = C000018: 0.1 µF ±10% 50V Ceramic Capacitor X7R 0603 (1608 Metric); ComponentLink1Description: DigiKey; ComponentLink1URL: https://www.digikey.com/en/products/detail/samsung-electro-mechanics/CL10B104KB8NNNC/3886658; DigiKey Part Number: 1276-1000-1-ND; capacitance: 0.1uF
C?#47 = C000021: 82 pF ±1% 25V Ceramic Capacitor C0G, NP0 0603 (1608 Metric); ComponentLink1Description: DigiKey; ComponentLink1URL: https://www.digikey.com/en/products/detail/kyocera-avx/KGM15ACG1E820FT/1599315?s=N4IgjCBcoMxaBjKAzAhgGwM4FMA0IB7KAbXDBggF18AHAFyhAGU6AnASwDsBzEAX3xgALPBBJIaLHkIlwAVgCcAJiEB2ENRD1GLDj36CAbKPGSc%2BIpFIxlQ45u2RmbLrwEglABiEKTKDOYyViAAHEoABDQAYhq0DE4AqpzsdADyyACy2KiYAK6s2AYgALRKfpBsudKWpHIafA1AA; DigiKey Part Number: 478-KGM15ACG1E820FTCT-ND; capacitance: 82pF
C?#48 C?#49 = C000007: as C?#36 on sheet 5V_SUPPLY; ComponentLink1Description: DigiKey; ComponentLink1URL: https://www.digikey.com/en/products/detail/kyocera-avx/06033C104K4T2A/8019250; DigiKey Part Number: 478-KAM15AR71E104KTCT-ND; capacitance: 100nF
C?#50-C?#53 = C000020: 22 µF ±10% 25V Ceramic Capacitor X5R 1206 (3216 Metric); ComponentLink1Description: DigiKey; ComponentLink1URL: https://www.digikey.com/en/products/detail/samsung-electro-mechanics/CL31A226KAHNNNE/3888705; DigiKey Part Number: 1276-3047-1-ND; capacitance: 22uF
C?#54 = C000019: 220 µF 50 V Aluminum Electrolytic Capacitors Radial, Can - SMD 7000 Hrs @ 105°C; ComponentLink1Description: DigiKey; ComponentLink1URL: https://www.digikey.com/en/products/detail/nichicon/UCW1H221MNL1GS/2549783; DigiKey Part Number: 493-9426-1-ND; capacitance: 220uF
C?#55-C?#57 = C000017: 10 µF ±10% 50V Ceramic Capacitor X7R 1206 (3216 Metric); ComponentLink1Description: DigiKey; ComponentLink1URL: https://www.digikey.com/en/products/detail/samsung-electro-mechanics/CL31B106KBHNNNE/5961251; DigiKey Part Number: 1276-6767-1-ND; capacitance: 10uF
C?#60 = C000011: 1 µF ±10% 10V Ceramic Capacitor X7R 0603 (1608 Metric); ComponentLink1Description: DigiKey; ComponentLink1URL: https://www.digikey.com/en/products/detail/samsung-electro-mechanics/CL10B105KP8NNNC/3887604; DigiKey Part Number: 1276-1946-2-ND; capacitance: 1uF
IC?#3 = LMR33630ARNXR: Buck Switching Regulator IC Positive Adjustable 1V 1 Output 3A 12-VFQFN; DigiKey Part Number: 296-49764-1-ND; ComponentLink1Description: DigiKey; ComponentLink1URL: https://www.digikey.com/en/products/detail/texas-instruments/LMR33630ARNXR/9356577; Mouser Part Number: 595-LMR33630ARNXR; ComponentLink2Description: Mouser; ComponentLink2URL: https://eu.mouser.com/ProductDetail/Texas-Instruments/LMR33630ARNXR?qs=55YtniHzbhBobt6bGtLStw%3D%3D
L?#4 = L000007: FIXED IND 12UH 5.9A 24 MOHM SMD; inductance: 12uH; DigiKey Part Number: 732-1224-1-ND; ComponentLink1Description: DigiKey; ComponentLink1URL: https://www.digikey.com/en/products/detail/w%C3%BCrth-elektronik/744770112/1638629
R?#20 R?#22 = R000011: as R?#9 on sheet 5V_SUPPLY; ComponentLink1Description: DigiKey; ComponentLink1URL: https://www.digikey.com/en/products/detail/panasonic-electronic-components/ERJ-6GEY0R00V/78163; resistance: 0 Ohm Jump; DigiKey Part Number: P0.0ACT-ND
R?#21 R?#23 = R000012: as R?#10 on sheet 5V_SUPPLY; ComponentLink1Description: DigiKey; ComponentLink1URL: https://www.digikey.com/en/products/detail/stackpole-electronics-inc/RMCF1206ZT0R00/1756906; resistance: 0 Ohm Jump; DigiKey Part Number: RMCF1206ZT0R00CT-ND
R?#24 R?#25 = R000006: as R?#16 on sheet 5V_SUPPLY; resistance: 100kOhm; ComponentLink1Description: DigiKey; ComponentLink1URL: https://www.digikey.com/en/products/detail/stackpole-electronics-inc/RMCF0603FG100K/1713543; DigiKey Part Number: RMCF0603FG100KCT-ND
R?#26 = R000017: 24.9 kOhms ±1% 0.1W, 1/10W Chip Resistor 0603 (1608 Metric) Automotive AEC-Q200 Thick Film; ComponentLink1Description: DigiKey; ComponentLink1URL: https://www.digikey.com/en/products/detail/panasonic-electronic-components/ERJ-3EKF2492V/196236; resistance: 24.9kOhm; DigiKey Part Number: P24.9KHCT-ND
TP?#23-TP?#30 = TP002: Test point 1mm

## Sheet REVERSE_PROTECTION.SchDoc
size A3; SheetNumber: 7; SheetTotal: 16
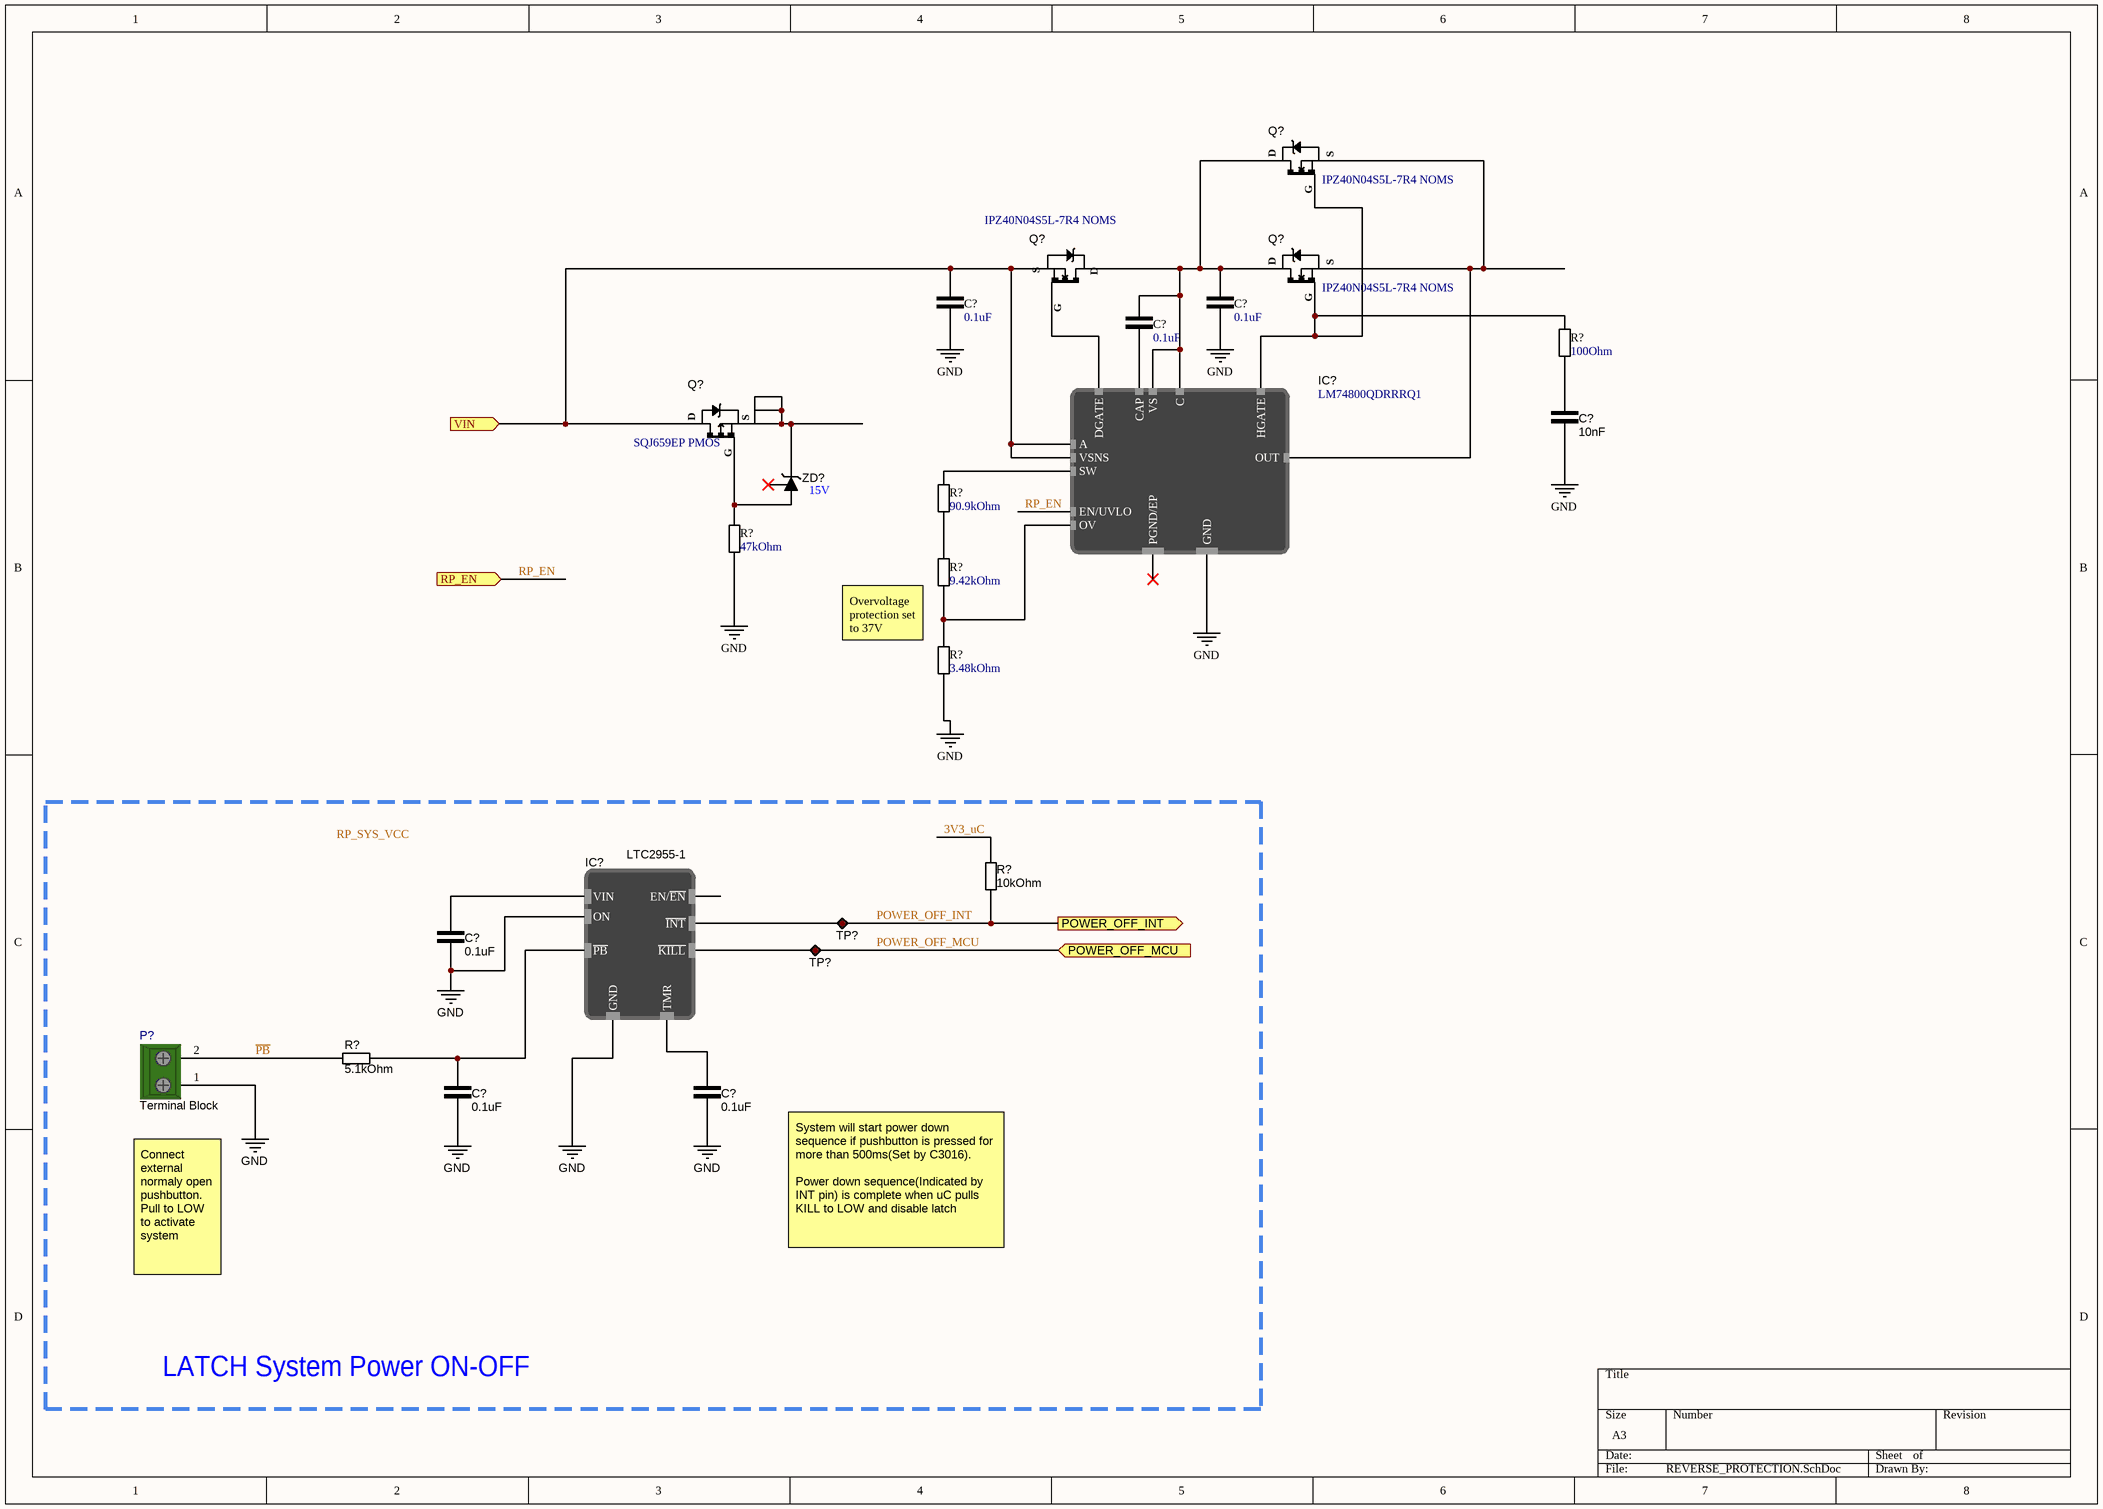
[diagram p6: REVERSE_PROTECTION.SchDoc]

### Parts
(Parts that share a designator on the sheet are numbered #1, #2 ... from top to bottom, then left to right.)
C?#61  0.1uF  [CAP_0603]
C?#62  0.1uF  [CAP_0603]
C?#63  0.1uF  [CAP_0603]
C?#64  10nF  [CAP_0603]
C?#65  0.1uF  [CAP_0603]
C?#66  0.1uF  [CAP_0603]
C?#67  0.1uF  [CAP_0603]
IC?#4  LM74800QDRRRQ1  [SON50P300X80_HS-13N]
IC?#5  LTC2955-1  [TSOP65P280X100-8N]
P?  Terminal Block  [TERM_BLOCK 5mm 2PIN]
Q?#5  IPZ40N04S5L-7R4 NOMS  [PG-TSDSON-8-32]
Q?#6  IPZ40N04S5L-7R4 NOMS  [PG-TSDSON-8-32]
Q?#7  IPZ40N04S5L-7R4 NOMS  [PG-TSDSON-8-32]
Q?#8  SQJ659EP PMOS  [PowerPAK SO-8L SINGLE]
R?#27  100Ohm  [RES_0603]
R?#28  90.9kOhm  [RES_0603]
R?#29  47kOhm  [RES_0603]
R?#30  9.42kOhm  [RES_0603]
R?#31  3.48kOhm  [RES_0603]
R?#32  10kOhm  [RES_0603]
R?#33  5.1kOhm  [RES_0603]
TP?#31  Test point  [TestPoint]  (value not drawn)
TP?#32  Test point  [TestPoint]  (value not drawn)
ZD?  DZ23C15-E3-08 Zener Diode  [SOT95P245X96-3N]  (value not drawn)

### Ports
POWER_OFF_INT (out), POWER_OFF_MCU (in), RP_EN (in), VIN (in)

### Nets
GND: C?#61.1 C?#62.1 C?#64.1 C?#65.1 C?#66.1 C?#67.1 IC?#4.7(GND) IC?#5.1(ON) IC?#5.4(GND) P?.1(pin1) R?#29.1 R?#31.1
3V3_uC: R?#32.2
~{PB}: P?.2(pin2) R?#33.1
POWER_OFF_INT: IC?#5.8(~{INT}) R?#32.1 TP?#31.1 ; port POWER_OFF_INT
POWER_OFF_MCU: IC?#5.2(~{KILL}) TP?#32.1 ; port POWER_OFF_MCU
RP_EN: IC?#4.6(EN/UVLO) ; port RP_EN
NetC?#61_2: C?#61.2 IC?#4.2(A) IC?#4.3(VSNS) Q?#6.S(Source) Q?#8.D ; port VIN
NetC?#62_2: C?#62.2 C?#63.2 IC?#4.10(VS) IC?#4.12(C) Q?#5.D(Drain) Q?#6.D(Drain) Q?#7.D(Drain)
NetC?#63_1: C?#63.1 IC?#4.11(CAP)
NetC?#64_2: C?#64.2 R?#27.1
NetC?#65_2: C?#65.2 IC?#5.6(VIN)
NetC?#66_2: C?#66.2 IC?#5.5(~{PB}) R?#33.2
NetC?#67_2: C?#67.2 IC?#5.3(TMR)
NetIC?#4_1: IC?#4.1(DGATE) Q?#6.G(Gate)
NetIC?#4_4: IC?#4.4(SW) R?#28.2
NetIC?#4_5: IC?#4.5(OV) R?#30.1 R?#31.2
NetIC?#4_8: IC?#4.8(HGATE) Q?#5.G(Gate) Q?#7.G(Gate) R?#27.2
NetIC?#4_9: IC?#4.9(OUT) Q?#5.S(Source) Q?#7.S(Source)
NetQ?#8_G: Q?#8.G R?#29.2 ZD?.1(Anode)
NetQ?#8_S: Q?#8.S(S1) ZD?.3(Cathode)
NetR?#28_1: R?#28.1 R?#30.2

Not connected (* = marked no-connect by the designer): IC?#4 13(PGND/EP)*; IC?#5 7(EN/~{EN}); ZD? 2(Anode)*

### Notes on the sheet
- (near ZD?) 15V
- (near R?#30) Overvoltage protection set to 37V
- System will start power down sequence if pushbutton is pressed for more than 500ms(Set by C3016).
  Power down sequence(Indicated by INT pin) is complete when uC pulls KILL to LOW and disable latch
- Connect external normaly open pushbutton.
  Pull to LOW to activate system
- LATCH System Power ON-OFF
- Labels drawn without touching a wire or pin: RP_SYS_VCC

### Library data of the parts
C?#61-C?#63 C?#65-C?#67 = C000018: as C?#46 on sheet 3V3_SUPPLY; ComponentLink1Description: DigiKey; ComponentLink1URL: https://www.digikey.com/en/products/detail/samsung-electro-mechanics/CL10B104KB8NNNC/3886658; DigiKey Part Number: 1276-1000-1-ND; capacitance: 0.1uF
C?#64 = C000034: 10000 pF ±10% 50V Ceramic Capacitor X7R 0603 (1608 Metric); ComponentLink1Description: DigiKey; ComponentLink1URL: https://www.digikey.com/en/products/detail/kemet/C0603C103K5RACTU/411090; DigiKey Part Number: 399-C0603C103K5RACTUCT-ND; capacitance: 10nF
IC?#4 = LM74800QDRRRQ1: OR Controller N+1 ORing Controller N-Channel 1:1 12-WSON (3x3); DigiKey Part Number: 296-LM74800QDRRRQ1CT-ND; ComponentLink1Description: DigiKey; ComponentLink1URL: https://www.digikey.com/en/products/detail/texas-instruments/LM74800QDRRRQ1/13627158; Mouser Part Number: 595-LM74800QDRRRQ1; ComponentLink2Description: Mouser; ComponentLink2URL: https://eu.mouser.com/ProductDetail/Texas-Instruments/LM74800QDRRRQ1?qs=KUoIvG%2F9IlYNgS7D9vQjYA%3D%3D
IC?#5 = LTC2955-1: Power Supply Controller Push Button, On/Off Controller TSOT-23-8; DigiKey Part Number: 505-LTC2955CTS8-1#TRMPBFCT-ND; ComponentLink1Description: DigiKey; ComponentLink1URL: https://www.digikey.com/en/products/detail/analog-devices-inc/LTC2955CTS8-1-TRMPBF/3065178; Mouser Part Number: 584-C2955CTS8-1TMPF; ComponentLink2Description: Mouser; ComponentLink2URL: https://eu.mouser.com/ProductDetail/Analog-Devices/LTC2955CTS8-1TRMPBF?qs=hVkxg5c3xu%252B6Fq1Ir3bkGg%3D%3D
P? = 00000001: Terminal block 90 deg 5mm 2PIN; ComponentLink1Description: DigiKey; ComponentLink1URL: https://www.digikey.com/en/products/detail/adam-tech/EB20-02-C/9831508; DigiKey part number: 2057-EB20-02-C-ND
Q?#5-Q?#7 = 00000007: N-Channel 40 V 40A (Tc) 34W (Tc) Surface Mount PG-TSDSON-8; DigiKey Part Number: IPZ40N04S5L7R4ATMA1CT-ND; Mouser Part Number: 726-IPZ40N04S5L7R4AT; ComponentLink1Description: DigiKey; ComponentLink1URL: https://www.digikey.com/en/products/detail/infineon-technologies/IPZ40N04S5L7R4ATMA1/5960382; ComponentLink2Description: Mouser; ComponentLink2URL: https://eu.mouser.com/ProductDetail/Infineon-Technologies/IPZ40N04S5L7R4ATMA1?qs=RJIhqtkBntMJfptUOROQRQ%3D%3D; ComponentLink3Description: Footprint Drawing; ComponentLink3URL: https://www.infineon.com/cms/en/product/packages/PG-TSDSON/PG-TSDSON-8-32/#!downloads
Q?#8 = 00000005: P-Channel 60 V 52A (Tc) 83W (Tc) Surface Mount PowerPAK® SO-8; DigiKey Part Number: SQJ459EP-T1_GE3CT-ND; Mouser Part Number: 78-SQJ459EP-T2_BE3; ComponentLink1Description: DigiKey; ComponentLink1URL: https://www.digikey.com/en/products/detail/vishay-siliconix/SQJ459EP-T1-GE3/6708881; ComponentLink2Description: Mouser; ComponentLink2URL: https://eu.mouser.com/ProductDetail/Vishay-Siliconix/SQJ459EP-T2_BE3?qs=CiayqK2gdcKpg8h0vLRPjA%3D%3D
R?#27 = R000030: 100 Ohms ±1% 0.1W, 1/10W Chip Resistor 0603 (1608 Metric) Moisture Resistant Thick Film; ComponentLink1Description: DigiKey; ComponentLink1URL: https://www.digikey.com/en/products/detail/yageo/RC0603FR-07100RL/726888; resistance: 100Ohm; DigiKey Part Number: 311-100HRCT-ND
R?#28 = R000027: 90.9 kOhms ±1% 0.1W, 1/10W Chip Resistor 0603 (1608 Metric) Automotive AEC-Q200 Thick Film; ComponentLink1Description: DigiKey; ComponentLink1URL: https://www.digikey.com/en/products/detail/panasonic-electronic-components/ERJ-3EKF9092V/196512; resistance: 90.9kOhm; DigiKey Part Number: P90.9KHCT-ND
R?#29 = R000010: 47 kOhms ±1% 0.1W, 1/10W Chip Resistor 0603 (1608 Metric) Moisture Resistant Thick Film; ComponentLink1Description: DigiKey; ComponentLink1URL: https://www.digikey.com/en/products/detail/yageo/RC0603FR-0747KL/727253; resistance: 47kOhm; DigiKey Part Number: 311-47.0KHRCT-ND
R?#30 = R000028: 9.42 kOhms ±1% 0.1W, 1/10W Chip Resistor 0603 (1608 Metric) Automotive AEC-Q200, Moisture Resistant Metal Film; ComponentLink1Description: DigiKey; ComponentLink1URL: https://www.digikey.com/en/products/detail/koa-speer-electronics-inc/RN73H1JTTD9421F25/10688584?s=N4IgjCBcoMxaBjKAzAhgGwM4FMA0IB7KAbXDBggF18AHAFyhAGU6AnASwDsBzEAX3xgAbPBBJIaLHkIkQMAJwAmACwjqIeoxYce-fIoAMADgCso8ZJz4ikUvIB0yxQAIA1gHkAFgFtMIdZqQIACqnOx07sgAstiomACurNh6IAC0iuZQbPHSNqRmlHwCIBm2IEmY7Jh0BKz%2BfEA; resistance: 9.42kOhm; DigiKey Part Number: 2019-RN73H1JTTD9421F25CT-ND
R?#31 = R000029: 3.48 kOhms ±1% 0.1W, 1/10W Chip Resistor 0603 (1608 Metric) Automotive AEC-Q200 Thick Film; ComponentLink1Description: DigiKey; ComponentLink1URL: https://www.digikey.com/en/products/detail/stackpole-electronics-inc/RMCF0603FT3K48/1761028; resistance: 3.48kOhm; DigiKey Part Number: RMCF0603FT3K48CT-ND
R?#32 = R000001: as R?#17 on sheet 5V_SUPPLY; resistance: 10kOhm; ComponentLink1Description: DigiKey; ComponentLink1URL: https://www.digikey.com/en/products/detail/vishay-beyschlag-draloric-bc-components/MCT06030C1002FP500/1850440; DigiKey Part Number: MCT0603-10.0K-CFCT-ND
R?#33 = R000013: 5.1 kOhms ±1% 0.1W, 1/10W Chip Resistor 0603 (1608 Metric) Moisture Resistant Thick Film; ComponentLink1Description: DigiKey; ComponentLink1URL: https://www.digikey.com/en/products/detail/yageo/RC0603FR-075K1L/727268; resistance: 5.1kOhm; DigiKey Part Number: 311-5.10KHRCT-ND
TP?#31 TP?#32 = TP002: Test point 1mm
ZD? = 00000006: Zener Diode Array 1 Pair Common Cathode 15 V 300 mW ±5% SOT-23-3; DigiKey Part Number: 112-DZ23C15-E3-08CT-ND; ComponentLink1Description: DigiKey; ComponentLink1URL: https://www.digikey.com/en/products/detail/vishay-general-semiconductor-diodes-division/DZ23C15-E3-08/4831460

## Sheet 3V3_MCU.SchDoc
size A4; SheetNumber: 8; SheetTotal: 16
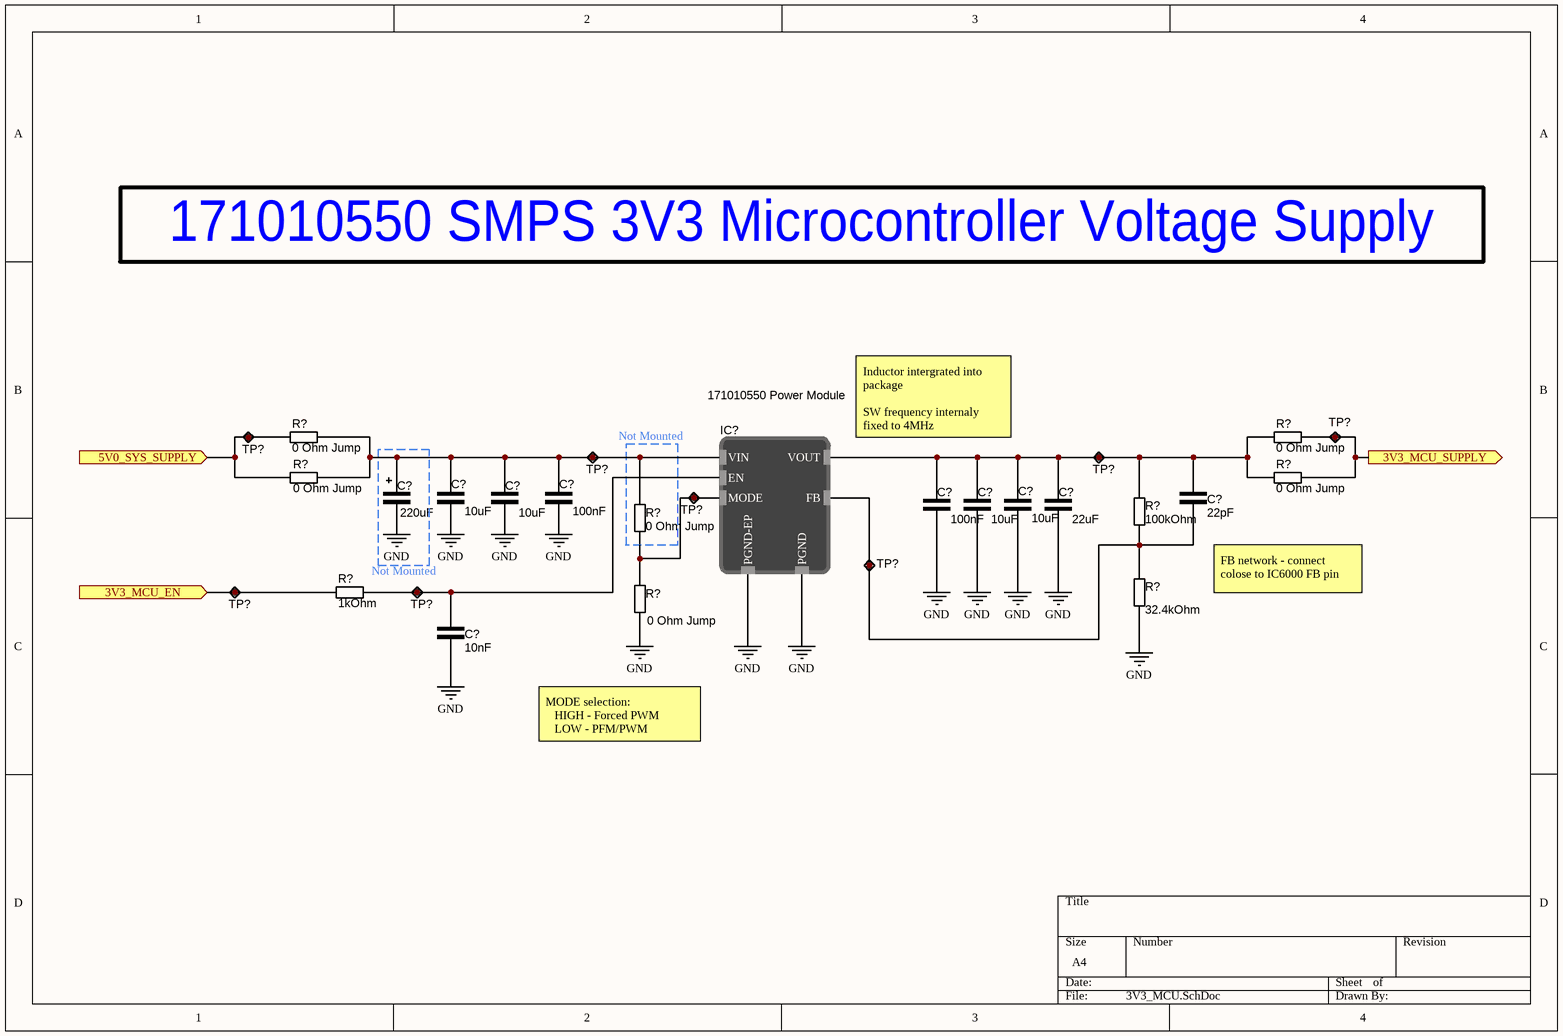
[diagram p7: 3V3_MCU.SchDoc]

### Parts
(Parts that share a designator on the sheet are numbered #1, #2 ... from top to bottom, then left to right.)
C?#68  220uF  [CAPAE9083X100M]
C?#69  10uF  [CAP_0805]
C?#70  10uF  [CAP_0805]
C?#71  100nF  [CAP_0603]
C?#72  22pF  [CAP_0603]
C?#73  100nF  [CAP_0603]
C?#74  10uF  [CAP_0805]
C?#75  10uF  [CAP_0805]
C?#76  22uF  [CAP_0805]
C?#77  10nF  [CAP_0603]
IC?#6  171010550 Power Module  [171010550]
R?#34  0 Ohm Jump  [RES_0603]
R?#35  0 Ohm Jump  [RES_0805]
R?#36  0 Ohm Jump  [RES_0603]
R?#37  0 Ohm Jump  [RES_0805]
R?#38  100kOhm  [RES_0603]
R?#39  0 Ohm Jump  [RES_0603]
R?#40  1kOhm  [RES_0603]
R?#41  32.4kOhm  [RES_0603]
R?#42  0 Ohm Jump  [RES_0603]
TP?#33  Test point  [TestPoint]  (value not drawn)
TP?#34  Test point  [TestPoint]  (value not drawn)
TP?#35  Test point  [TestPoint]  (value not drawn)
TP?#36  Test point  [TestPoint]  (value not drawn)
TP?#37  Test point  [TestPoint]  (value not drawn)
TP?#38  Test point  [TestPoint]  (value not drawn)
TP?#39  Test point  [TestPoint]  (value not drawn)
TP?#40  Test point  [TestPoint]  (value not drawn)

### Ports
3V3_MCU_EN (in), 3V3_MCU_SUPPLY (out), 5V0_SYS_SUPPLY (in)

### Nets
GND: C?#73.1 C?#74.1 C?#75.2 C?#76.2 C?#77.1 IC?#6.5(PGND) IC?#6.EP(PGND-EP) R?#41.1 R?#42.1
NetC?#68_2: C?#68.2 C?#69.1 C?#70.2 C?#71.1 IC?#6.4(VIN) R?#34.2 R?#36.1 R?#39.2 TP?#35.1
NetC?#72_1: C?#72.1 IC?#6.1(FB) R?#38.1 R?#41.2 TP?#38.1
NetC?#72_2: C?#72.2 C?#73.2 C?#74.2 C?#75.1 C?#76.1 IC?#6.6(VOUT) R?#35.1 R?#37.1 R?#38.2 TP?#36.1
NetC?#77_2: C?#77.2 IC?#6.3(EN) R?#40.2 TP?#40.1
NetIC?#6_2: IC?#6.2(MODE) R?#39.1 R?#42.2 TP?#37.1
NetR?#34_1: R?#34.1 R?#36.2 TP?#33.1 ; port 5V0_SYS_SUPPLY
NetR?#35_2: R?#35.2 R?#37.2 TP?#34.1 ; port 3V3_MCU_SUPPLY
NetR?#40_1: R?#40.1 TP?#39.1 ; port 3V3_MCU_EN

Not connected (* = marked no-connect by the designer): C?#68 1; C?#69 2; C?#70 1; C?#71 2

### Notes on the sheet
- 171010550 SMPS 3V3 Microcontroller Voltage Supply
- Not Mounted
- (near IC?#6) Inductor intergrated into package
  SW frequency internaly fixed to 4MHz
- FB network - connect colose to IC6000 FB pin
- MODE selection:
  HIGH - Forced PWM
  LOW - PFM/PWM
- Labels drawn without touching a wire or pin: GND

### Library data of the parts
C?#68 = C000025: 220 µF 10 V Aluminum - Polymer Capacitors Radial, Can - SMD 20mOhm 2000 Hrs @ 105°C; ComponentLink1Description: DigiKey; ComponentLink1URL: https://www.digikey.com/en/products/detail/kemet/A765KN227M1ALAE020/6196558; DigiKey Part Number: 399-A765KN227M1ALAE020CT-ND; capacitance: 220uF
C?#69 C?#70 C?#74 C?#75 = C000002: as C?#34 on sheet 5V_SUPPLY; ComponentLink1Description: DigiKey; ComponentLink1URL: https://www.digikey.com/en/products/detail/tdk-corporation/C2012X5R1E106K125AB/2443462; DigiKey Part Number: 445-5984-1-ND; capacitance: 10uF
C?#71 C?#73 = C000007: as C?#36 on sheet 5V_SUPPLY; ComponentLink1Description: DigiKey; ComponentLink1URL: https://www.digikey.com/en/products/detail/kyocera-avx/06033C104K4T2A/8019250; DigiKey Part Number: 478-KAM15AR71E104KTCT-ND; capacitance: 100nF
C?#72 = C000024: 22 pF ±10% 25V Ceramic Capacitor X7R 0603 (1608 Metric); ComponentLink1Description: DigiKey; ComponentLink1URL: https://www.digikey.com/en/products/detail/kemet/C0603C220K3RACAUTO/16524857; DigiKey Part Number: 399-C0603C220K3RACAUTOCT-ND; capacitance: 22pF
C?#76 = C000001: as C?#39 on sheet 5V_SUPPLY; ComponentLink1Description: DigiKey; ComponentLink1URL: https://www.digikey.com/en/products/detail/tdk-corporation/C2012X5R1E226M125AC/3661564; DigiKey Part Number: 445-9112-1-ND; capacitance: 22uF
C?#77 = C000005: as C?#45 on sheet 5V_SUPPLY; ComponentLink1Description: DigiKey; ComponentLink1URL: https://www.digikey.com/en/products/detail/kyocera-avx/06033C103MAT2A/1599370; DigiKey Part Number: 478-KGM15AR71E103MTCT-ND; capacitance: 10nF
IC?#6 = 171010550: Non-Isolated PoL Module DC DC Converter 1 Output 0.8 ~ 5.5V 1.2A 2.5V - 5.5V Input; DigiKey Part Number: 732-171010550CT-ND; Mouser Part Number: 710-171010550; ComponentLink1Description: DigiKey; ComponentLink1URL: https://www.digikey.com/en/products/detail/w%C3%BCrth-elektronik/171010550/10468263; ComponentLink2Description: Mouser; ComponentLink2URL: https://eu.mouser.com/ProductDetail/Wurth-Elektronik/171010550?qs=d0WKAl%252BL4KaovukkXP8RVA%3D%3D
R?#34 R?#36 R?#39 R?#42 = R000007: as R?#14 on sheet 5V_SUPPLY; ComponentLink1Description: DigiKey; ComponentLink1URL: https://www.digikey.com/en/products/detail/stackpole-electronics-inc/RMCF0603ZT0R00/1756908; resistance: 0 Ohm Jump; DigiKey Part Number: RMCF0603ZT0R00CT-ND
R?#35 R?#37 = R000011: as R?#9 on sheet 5V_SUPPLY; ComponentLink1Description: DigiKey; ComponentLink1URL: https://www.digikey.com/en/products/detail/panasonic-electronic-components/ERJ-6GEY0R00V/78163; resistance: 0 Ohm Jump; DigiKey Part Number: P0.0ACT-ND
R?#38 = R000006: as R?#16 on sheet 5V_SUPPLY; resistance: 100kOhm; ComponentLink1Description: DigiKey; ComponentLink1URL: https://www.digikey.com/en/products/detail/stackpole-electronics-inc/RMCF0603FG100K/1713543; DigiKey Part Number: RMCF0603FG100KCT-ND
R?#40 = R000004: as R?#13 on sheet 5V_SUPPLY; resistance: 1kOhm; ComponentLink1Description: DigiKey; ComponentLink1URL: https://www.digikey.com/en/products/detail/vishay-beyschlag-draloric-bc-components/MCT06030C1001FP500/2607821; DigiKey Part Number: MCT0603-1.00K-CFCT-ND
R?#41 = R000014: 32.4 kOhms ±1% 0.1W, 1/10W Chip Resistor 0603 (1608 Metric) Moisture Resistant Thick Film; ComponentLink1Description: DigiKey; ComponentLink1URL: https://www.digikey.com/en/products/detail/bourns-inc/CR0603-FX-3242ELF/3783945; resistance: 32.4kOhm; DigiKey Part Number: CR0603-FX-3242ELFCT-ND
TP?#33-TP?#40 = TP002: Test point 1mm

## Sheet AC_CONTROL.SchDoc
size A2; SheetNumber: 10; SheetTotal: 10

## Sheet SENSOR_INTERFACE.SchDoc
size A2; SheetNumber: 9; SheetTotal: 9

## Sheet LED_AND_BUZZER.SchDoc
size A4; SheetNumber: 14; SheetTotal: 16

## Sheet WiFI_ESP32.SchDoc
size A4; SheetNumber: 15; SheetTotal: 16

## Sheet MAIN_CONTROLLER.SchDoc
size A2; SheetNumber: 14; SheetTotal: 14

## Nets that join several sheets
GND: 12V_SUPPLY (48 pins), 5V_SUPPLY (14 pins), 3V3_SUPPLY (16 pins), REVERSE_PROTECTION (12 pins), 3V3_MCU (9 pins)
NetC?#61_2: 12V_SUPPLY (Q_RP?.D TVS?.1), REVERSE_PROTECTION (5 pins)